# EasyEDA Pro project 基于LM2596的12V转53.3V.epro

# Schematic 基于LM2596的12V转53.3V copy
Board Name: 基于LM2596的12V转53.3V copy; Create Date: 2025-03-05; Page Name: Sheet_1 copy; Project Name: 基于LM2596的12V转53.3V copy_2025-03-05_14-51-58; Schematic Name: 基于LM2596的12V转53.3V copy; Update Date: 2025-03-08; Add into BOM: yes; Company: Your Company; Convert to PCB: yes; Date: 2021-05-23; Draw By: 衬衫的价格为九镑十五便士; REV: 1.0; Sheet: 1/1
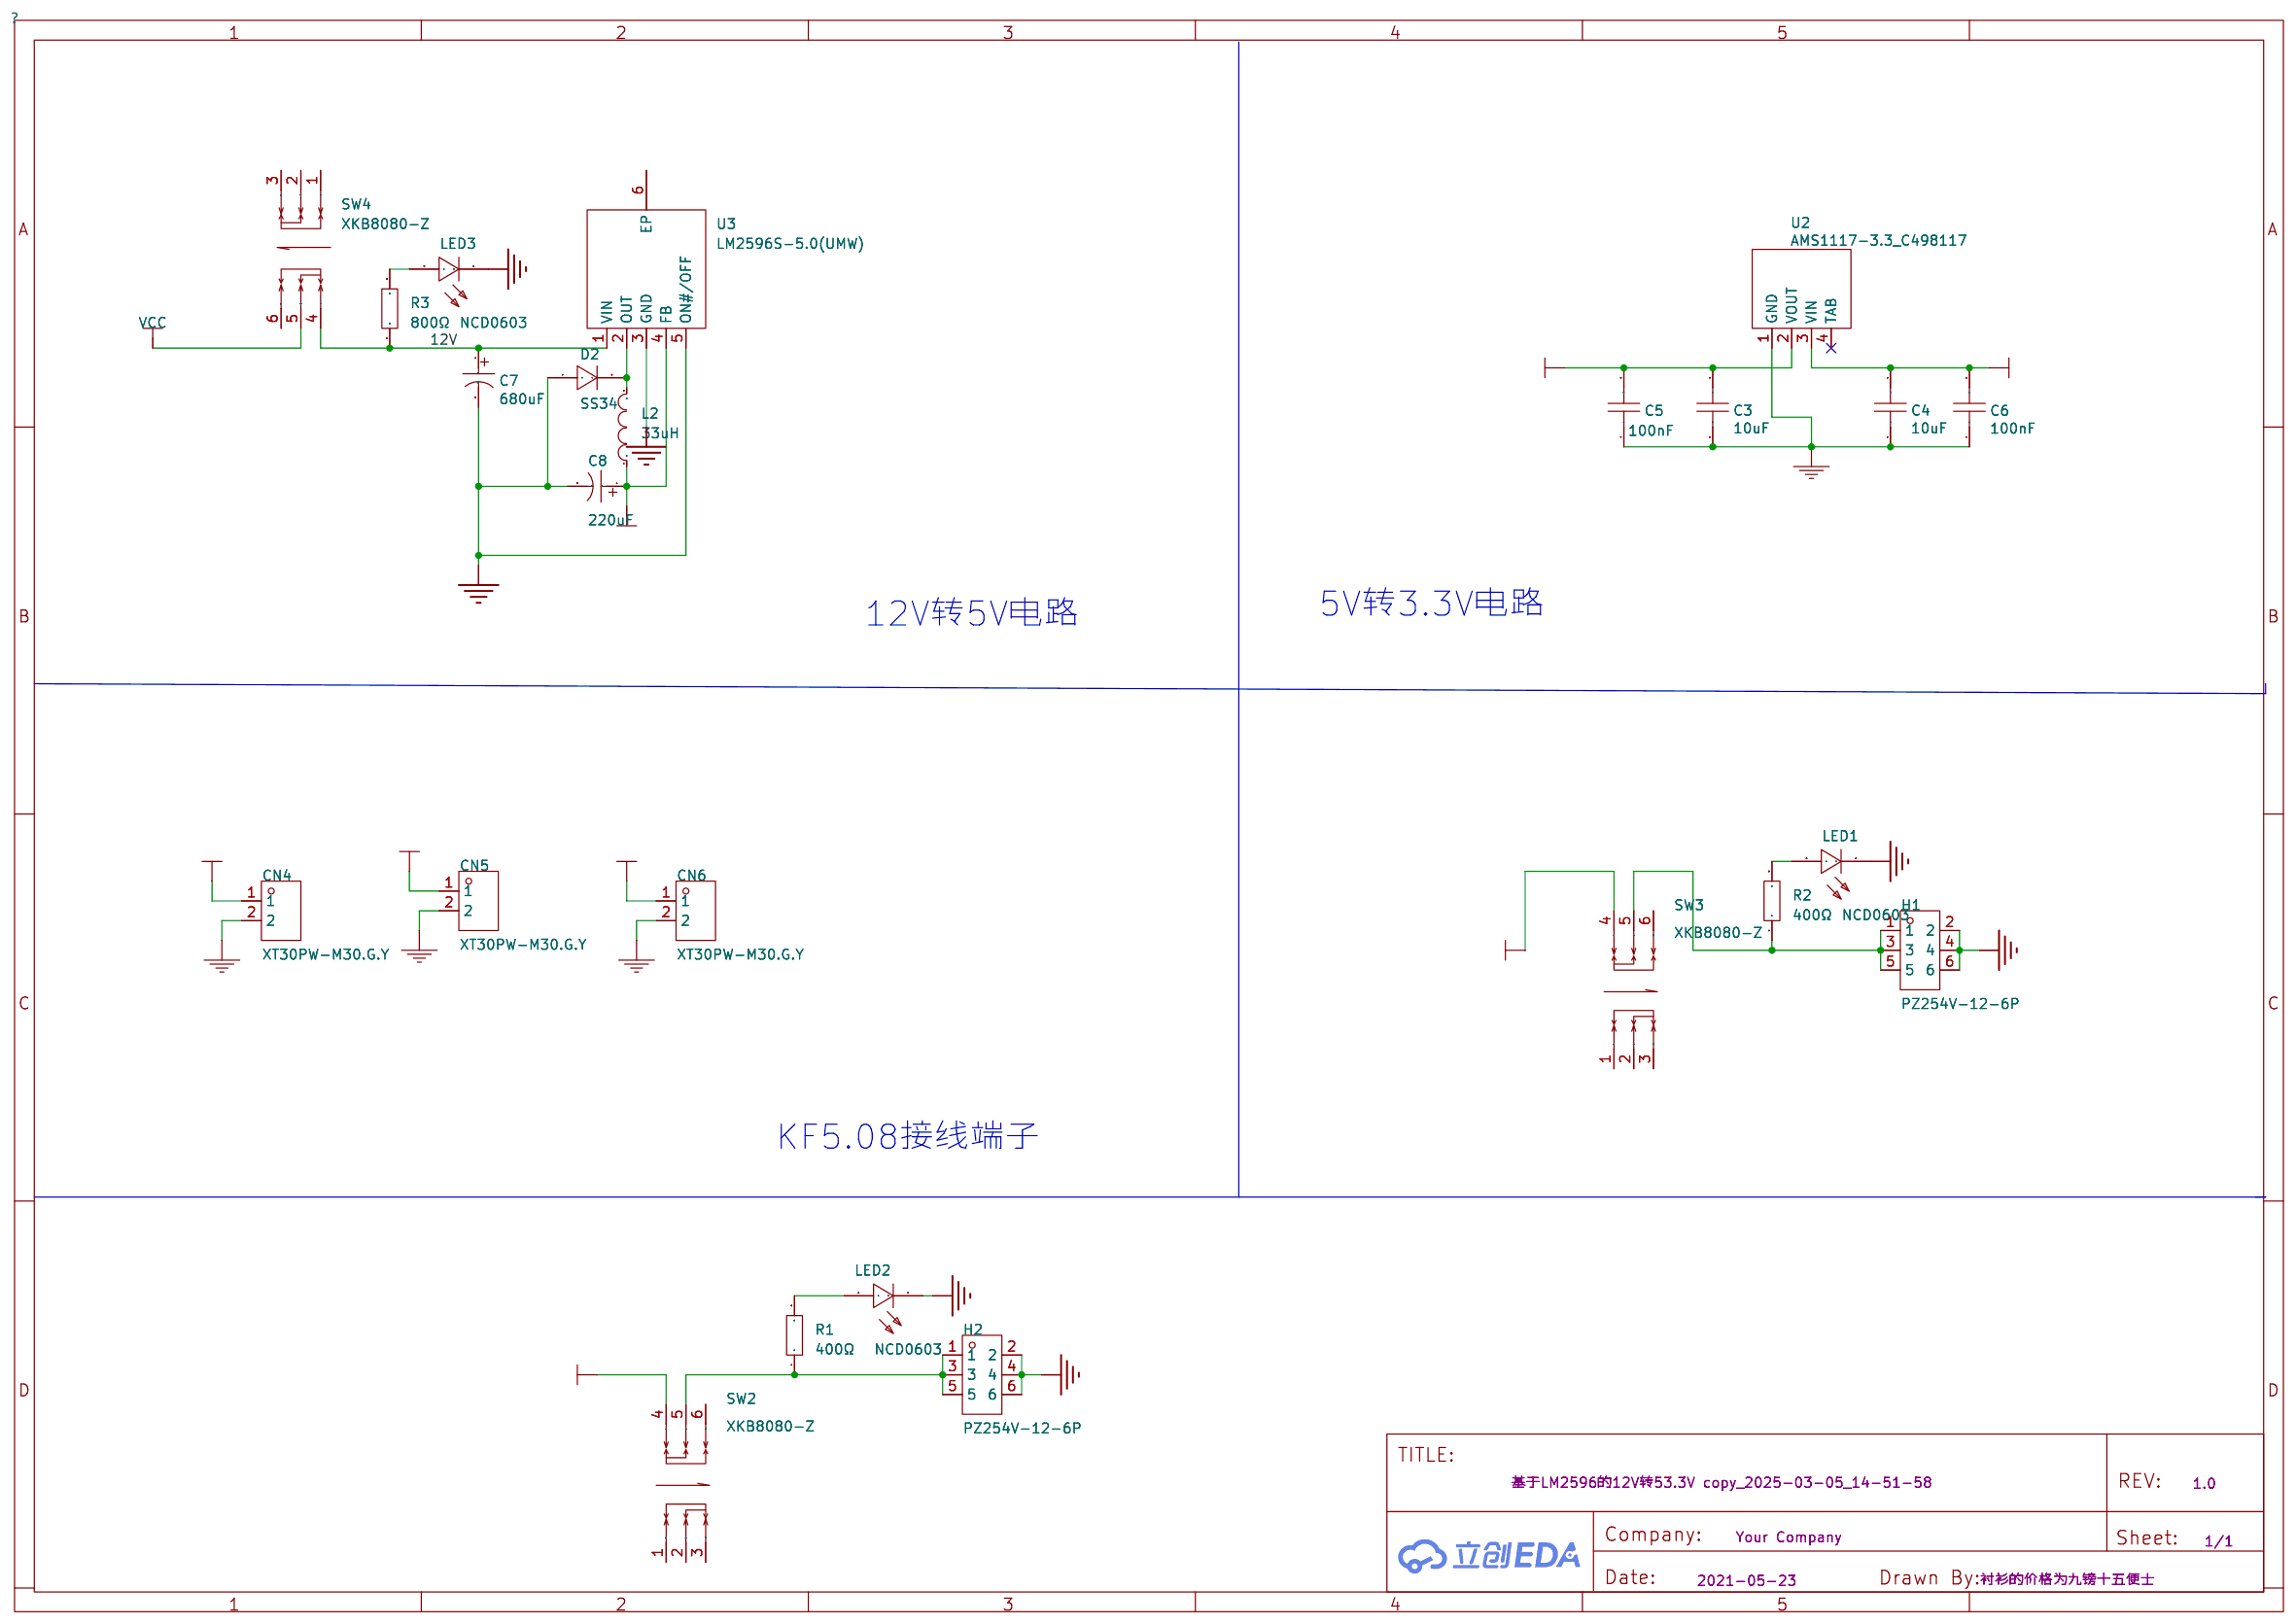
[diagram p0: schematic sheet]

## Parts
C3  10uF  [C0603]
C4  10uF  [C0603]
C5  100nF  [C0603]
C6  100nF  [C0603]
C7  680uF  [CAP-SMD_BD10.0-L10.3-W10.3-LS10.9-FD]
C8  220uF  [CAP-SMD_BD6.3-L6.6-W6.6-LS7.8-FD]
CN4  XT30PW-M30.G.Y  [CONN-TH_XT30PW-M]
CN5  XT30PW-M30.G.Y  [CONN-TH_XT30PW-M]
CN6  XT30PW-M30.G.Y  [CONN-TH_XT30PW-M]
D2  SS34  [SMC_L6.9-W5.9-LS7.9-RD]
H1  PZ254V-12-6P  [HDR-TH_6P-P2.54-V-M-R2-C3-S2.54]
H2  PZ254V-12-6P  [HDR-TH_6P-P2.54-V-M-R2-C3-S2.54]
L2  33uH  [IND-SMD_L7.0-W6.6_FXL0650]
LED1  NCD0603  [LED0603-RD_RED]
LED2  NCD0603  [LED0603-RD_RED]
LED3  NCD0603  [LED0603-RD_RED]
R1  400Ω  [R0603]
R2  400Ω  [R0603]
R3  800Ω  [R0603]
SW2  XKB8080-Z  [SW-TH_6P-L8.0-W8.0-P2.50]
SW3  XKB8080-Z  [SW-TH_6P-L8.0-W8.0-P2.50]
SW4  XKB8080-Z  [SW-TH_6P-L8.0-W8.0-P2.50]
U2  AMS1117-3.3_C498117  [PG-SOT223-4_L6.5-W3.5-P2.30-LS7.0-BR]
U3  LM2596S-5.0(UMW)  [TO-263-5_L10.2-W8.9-P1.70-BR]

## Library data of the parts
C3 C4 = GRT188R61E106ME13D: Supplier: LCSC; Supplier Part: C697423; Manufacturer: Murata Electronics; JLCPCB Part Class: Extended Part
C5 C6 = CT41-0603-2F4-50V-0.1uF-M(N): Supplier: LCSC; Supplier Part: C138344; Manufacturer: TORCH
C7 = GVM1V681M1010: 容值:680uF;精度:±20%;额定电压:35V;纹波电流:1.19A@120Hz;等效串联电阻:60mΩ@120Hz;; LCSC Part Name: 680uF ±20% 35V; Supplier Part: C2980172; Manufacturer: HONOR(荣誉); Supplier Footprint: SMD,D10xL10.5mm; JLCPCB Part Class: Extended Part; Datasheet: https://atta.szlcsc.com/upload/public/pdf/source/20220509/EB2A569F0F3393644DE07704993C28AA.pdf; Supplier: LCSC; Tolerance: ±20%; Rated Voltage: 35V; Ripple Current: 1.19A@120Hz; Equivalent Series Resistance(ESR): 60mΩ@120Hz; φD: 10mm; L: 10.2mm; Lifetime @ Temp: 5000hrs@105℃; Operating Temperature: -55℃~+105℃
C8 = GVT1E227M0608CNVC: 容值:220uF;精度:±20%;额定电压:25V;纹波电流:120mA@120Hz;; LCSC Part Name: 220uF ±20% 25V; Supplier Part: C2983317; Manufacturer: HRK(鸿瑞凯电子); Supplier Footprint: SMD,D6.3xL7.7mm; JLCPCB Part Class: Extended Part; Datasheet: https://atta.szlcsc.com/upload/public/pdf/source/20220321/A04A91A46495B899B204BF58325E1842.pdf; Supplier: LCSC; Tolerance: ±20%; Rated Voltage: 25V; Ripple Current: 120mA@120Hz; φD: 6.3mm; L: 8mm; Lifetime @ Temp: 2000hrs@105℃; Operating Temperature: -55℃~+105℃
CN4-CN6 = XT30PW-M30.G.Y: 类别:-;类型1:-;; LCSC Part Name: AMASS(艾迈斯)航模插头 卧式弯脚 XT30PW-M公头; Supplier Part: C431092; Manufacturer: AMASS(艾迈斯); JLCPCB Part Class: Extended Part; Datasheet: https://atta.szlcsc.com/upload/public/pdf/source/20220222/6A9F22F7850E25B33E1BE430ADF8560B.pdf; Supplier: LCSC; Type: 航模插头; RatedVoltage: DC 500V; InterfaceType: 公头; RatedCurrent: 15A; RecommendedWireGauge: 16/18/20AWG; contact resistance: 1.2mΩ; specifications: 2pin
D2 = SS34_C154551: 正向压降(Vf):500mV@3A;直流反向耐压(Vr):40V;整流电流:3A;; LCSC Part Name: 电压:40V 电流:3A; Supplier Part: C154551; Manufacturer: onsemi(安森美); Supplier Footprint: SMC(DO-214AB); JLCPCB Part Class: Extended Part; Datasheet: https://atta.szlcsc.com/upload/public/pdf/source/20230523/C977B907190B075B30FD168351032A84.pdf; Supplier: LCSC; Forward Voltage (Vf@If): 500mV@3A; Reverse Voltage (Vr): 40V; Rectified Current: 3A; Reverse Leakage Current (Ir): 500uA@40V
H1 H2 = PZ254V-12-6P: 插针结构:2x3P;间距:2.54mm;行距:2.54mm;圆针/方针:方针;安装类型:直插;排数:双排;总PIN位数:6P;额定电流:-;额定电压:-;配合针长度:6mm;塑高:2.5mm;端接针长度:3mm;触头材质:黄铜;触头镀层:-;工作温度范围:-40℃~+105℃;颜色:黑色;; LCSC Part Name: 间距:2.54mm 2x3P 直插 方针; Supplier Part: C492420; Manufacturer: XFCN(兴飞); Supplier Footprint: 插件,P=2.54mm; JLCPCB Part Class: 扩展库; Datasheet: https://atta.szlcsc.com/upload/public/pdf/source/20200309/C492420_BAECB307B001054C09D200388220EAE6.pdf; Supplier: LCSC; Pin Structure: 2x3P; Pitch: 2.54mm; Row Spacing: 2.54mm; Circluar Pins/Square Pins: 方针; Mounting Type: 直插; Number of Rows: 双排; Number of Pins: 6P; Length of Mating Pin: 6mm; Insulation Height: 2.5mm; Length of End Connection Pin: 3mm; Contact Material: 黄铜; Operating Temperature Range: -40℃~+105℃; Color: 黑色
L2 = FXL0650-330-M: 电感值:33uH;精度:±20%;额定电流:2.3A;饱和电流(Isat):3A;类型:一体成型电感;; LCSC Part Name: 33uH ±20% 3A; Supplier Part: C475526; Manufacturer: cjiang(长江微电); Supplier Footprint: SMD,6.6x7mm; JLCPCB Part Class: Extended Part; Datasheet: https://atta.szlcsc.com/upload/public/pdf/source/20240426/3189EA8206330E2108542F9E34E540E7.pdf; Supplier: LCSC; Tolerance: ±20%; Rated Current: 2.3A; Saturation Current (Isat): 3A; DC Resistance (DCR): 190mΩ; Type: 一体成型电感
LED1-LED3 = NCD0603R1_C84263: 灯头类型:-;发光颜色:红色;正向电压(VF):1.6V~2.6V;功率:65mW;正向电流:20mA;主波长:615nm~630nm;二极管配置:独立二极管;透镜颜色:无色透明透镜;色温:-;发光强度:80mcd~220mcd;发光角度:130°;载带方式:-;工作温度:-30℃~+85℃;; LCSC Part Name: NCD0603R1; Supplier Part: C84263; Manufacturer: 国星光电; Supplier Footprint: 0603; JLCPCB Part Class: 扩展库; Datasheet: https://atta.szlcsc.com/upload/public/pdf/source/20200820/C84263_DABC6A75E58F576973B407FDBA283D60.pdf; Supplier: LCSC; Emitted Color: 红色; Forward Voltage (VF): 1.6V~2.6V; Power Dissipation: 65mW; Forward Current: 20mA; Dominant Wavelength: 615nm~630nm; Diode Configuration: 独立二极管; Lens Color: 无色透明透镜; Luminous Intensity: 80mcd~220mcd; Viewing Angle: 130°; Operating Temperature: -30℃~+85℃
R1-R3 = Res_0603: Supplier Footprint: 0603
SW2-SW4 = XKB8080-Z: 自锁/无锁:自锁;安装方式:直插;触点电流:100mA;额定电压 (AC):250V;额定电压 (DC):30V;带灯:不带;作用力:160gf;机械寿命:10万次;; LCSC Part Name: 8*8 蓝白黑 自锁开关; Supplier Part: C318860; Manufacturer: XKB Connectivity(中国星坤); Supplier Footprint: 插件; JLCPCB Part Class: 扩展库; Datasheet: https://atta.szlcsc.com/upload/public/pdf/source/20200227/C318861_0CCDF4510CAD1098054D1FAD25282ED5.pdf; Supplier: LCSC; Self Lock / No Lock: 自锁; Actuator Style: 矩形按钮; Mounting Style: 直插; Contact Current: 100mA; Voltage Rating (AC): 250V; Voltage Rating (DC): 30V; Insulation Resistance: 100MΩ; Actuator/Cap Color: 蓝色; With Lamp: 不带; Pin Style: PC引脚; Operating Force: 160gf; Operating Temperature: -15℃~+55℃; Mechanical Life: 10万次
U2 = AMS1117-3.3: Supplier: LCSC; Supplier Part: C498117; Manufacturer: HGC(Huaguan Semicon); JLCPCB Part Class: Extended Part
U3 = LM2596S-5.0(UMW): 功能类型:降压型;输出类型:固定;工作电压:7V~40V;输出电压:5V;输出电流:3A;; LCSC Part Name: 3A降压稳压器; Supplier Part: C347421; Manufacturer: UMW(友台半导体); Supplier Footprint: TO-263-5; JLCPCB Part Class: Extended Part; Datasheet: https://atta.szlcsc.com/upload/public/pdf/source/20241113/7515F50B4FEE0270D4DE7078364C87FA.pdf; Supplier: LCSC; Function: 降压型; Output Type: 固定; Input Voltage: 7V~40V; Output Voltage: 5V; Output Current: 3A; Switching Frequency: 150kHz; Operating Temperature: -40℃~+125℃@(TA); Synchronous Rectification: 否; Number of Outputs: 1; Topology: 降压式; Quiescent Current (Iq): 80uA; Switch tube (built-in/external): 内置

## Nets
3.3V: C3.1 C5.2 SW2.4 U2.2(VOUT)
5V: C4.1 C6.2 C8.1 L2.1 SW3.4 U2.3(VIN) U3.4(FB)
12V: C7.1 CN5.1 CN6.1 R3.1 SW4.4 U3.1(VIN)
GND: C3.2 C4.2 C5.1 C6.1 C7.2 C8.2 CN4.2 CN5.2 CN6.2 D2.1(A) H1.2 H1.4 H1.6 H2.2 H2.4 H2.6 LED1.1(K) LED2.1(K) LED3.1(K) U2.1(GND) U3.3(GND) U3.5(ON#/OFF)
VCC: CN4.1 SW4.5
$1N1457: D2.2(K) L2.2 U3.2(OUT)
$1N4140: LED1.2(A) R2.2
$1N4171: LED2.2(A) R1.2
$1N4370: LED3.2(A) R3.2
Net-(H1-1): H1.1 H1.3 H1.5 R2.1 SW3.5
Net-(H2-1): H2.1 H2.3 H2.5 R1.1 SW2.5

Not connected (* = marked no-connect by the designer): SW2 1 2 3 6; SW3 1 2 3 6; SW4 1 2 3 6; U2 4(TAB)*; U3 6(EP)

## Notes on the sheet
- 12V转5V电路
- 5V转3.3V电路
- KF5.08接线端子

# Schematic 基于LM2596的12V转53.3V copy copy
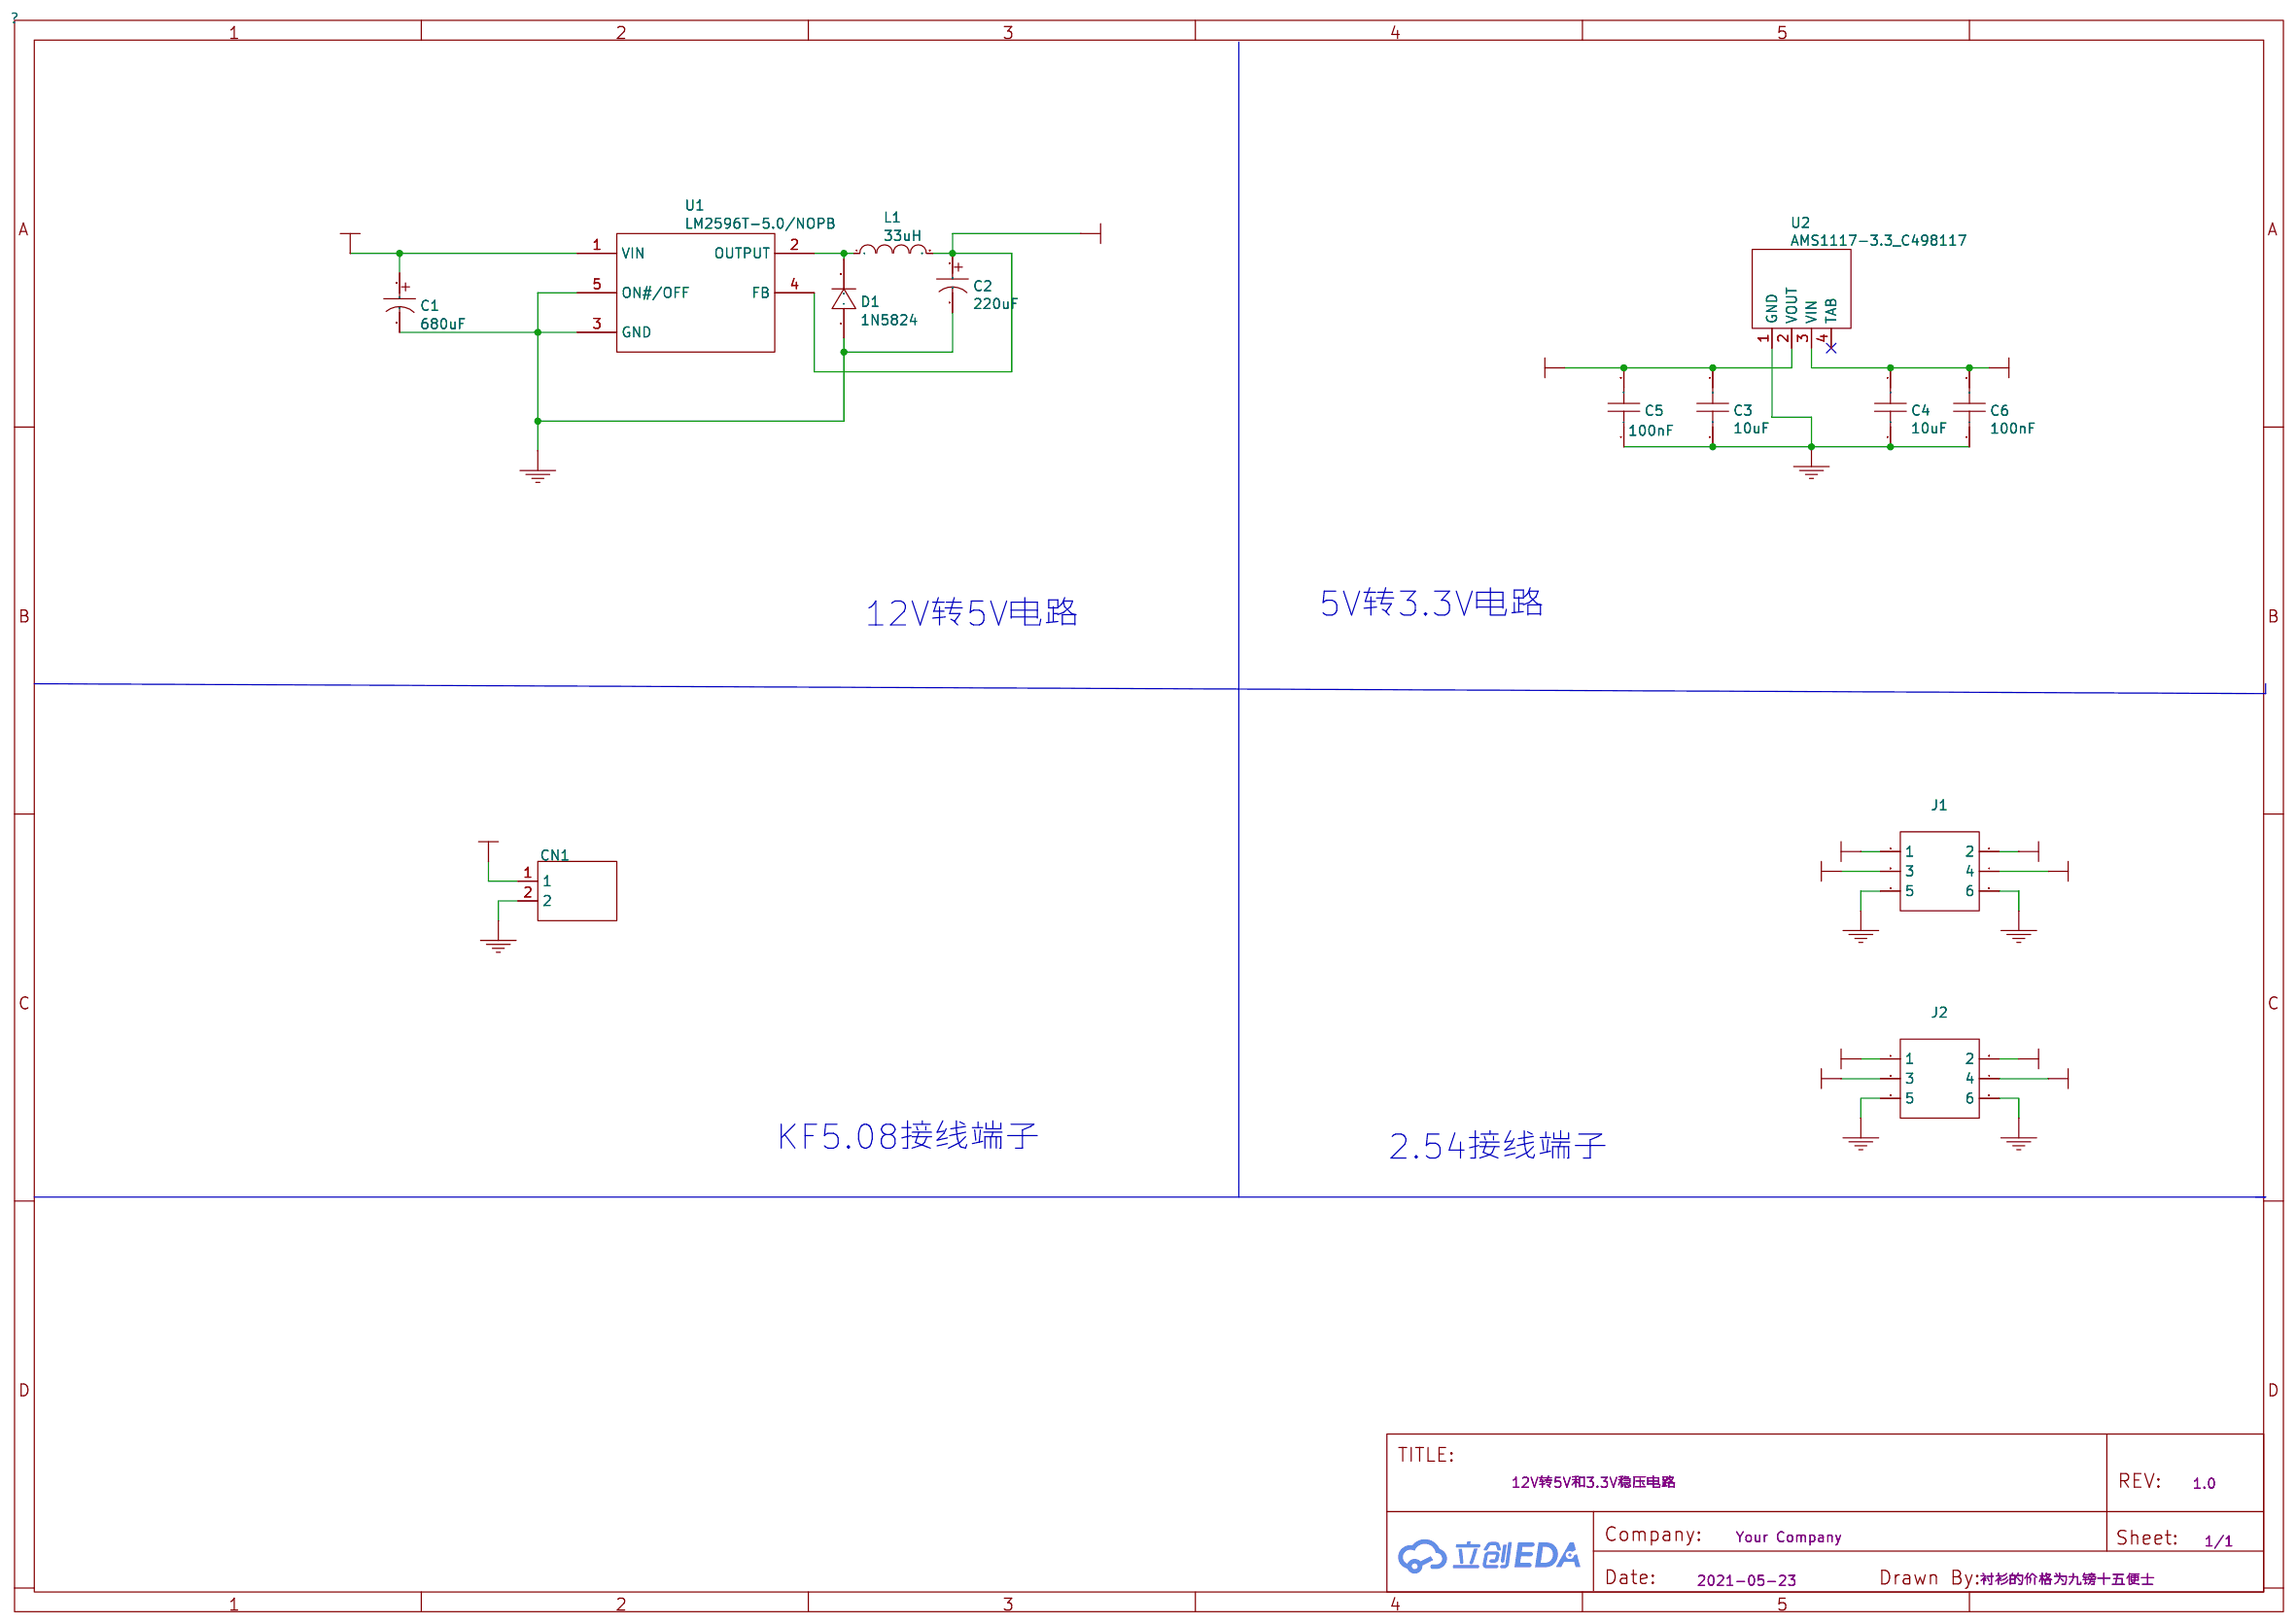
[diagram p1: schematic sheet]

## Parts
C1  680uF  [CAP-TH_BD12.5-P5.00-D1.2-FD]
C2  220uF  [CAP-TH_BD8.0-P3.50-D1.0-FD]
C3  10uF  [C0603]
C4  10uF  [C0603]
C5  100nF  [C0603]
C6  100nF  [C0603]
CN1  WJ127-5.0-2P_C187897  [CONN-TH_2P-P5.00_WJ127-5.0-2P]
D1  1N5824  [IN5824]
J1  Header-Male-2.54_2x3  [HDR-TH_6P-P2.54-V-R2-C3-S2.54]
J2  Header-Male-2.54_2x3  [HDR-TH_6P-P2.54-V-R2-C3-S2.54]
L1  33uH  [IND-SMD_L6.0-W6.0]
U1  LM2596T-5.0/NOPB  [TO-220-5_L10.5-W15.5-P1.70-TL]
U2  AMS1117-3.3_C498117  [PG-SOT223-4_L6.5-W3.5-P2.30-LS7.0-BR]

## Library data of the parts
C1 = 680UF/50V Black high frequency: Supplier: LCSC; Manufacturer: ValuePro; Supplier Part: C26225
C2 = 220uF 25V 8*12: Supplier: LCSC; Manufacturer: ValuePro; Supplier Part: C43837
C3 C4 = GRT188R61E106ME13D: Supplier: LCSC; Supplier Part: C697423; Manufacturer: Murata Electronics; JLCPCB Part Class: Extended Part
C5 C6 = CT41-0603-2F4-50V-0.1uF-M(N): Supplier: LCSC; Supplier Part: C138344; Manufacturer: TORCH
CN1 = WJ127-5.0-2P: Supplier: LCSC; Supplier Part: C187897; Manufacturer: Ningbo Kangnex Elec
D1 = 1N5824
J1 J2 = Header-Male-2.54_2x3: Supplier: LCSC; Manufacturer: BOOMELE; Supplier Part: C65114; JLCPCB Part Class: Extended Part
L1 = CKCS6045-33uH/M: Supplier: LCSC; Supplier Part: C354635; Manufacturer: CENKER; JLCPCB Part Class: Extended Part
U1 = LM2596T-5.0/NOPB: Supplier: LCSC; Manufacturer: TI; Supplier Part: C9714; JLCPCB Part Class: Extended Part
U2 = AMS1117-3.3: Supplier: LCSC; Supplier Part: C498117; Manufacturer: HGC(Huaguan Semicon); JLCPCB Part Class: Extended Part

## Nets
3.3V: C3.1 C5.2 J1.3 J1.4 J2.3 J2.4 U2.2(VOUT)
5V: C2.1 C4.1 C6.2 J1.1 J1.2 J2.1 J2.2 L1.2 U1.4(FB) U2.3(VIN)
12V: C1.1 CN1.1 U1.1(VIN)
GND: C1.2 C2.2 C3.2 C4.2 C5.1 C6.1 CN1.2 D1.1(A) J1.5 J1.6 J2.5 J2.6 U1.3(GND) U1.5(ON#/OFF) U2.1(GND)
U1_2: D1.2(K) L1.1 U1.2(OUTPUT)

Not connected (* = marked no-connect by the designer): U2 4(TAB)*

## Notes on the sheet
- 12V转5V电路
- 5V转3.3V电路
- KF5.08接线端子
- 2.54接线端子

# Schematic 基于LM2596的12V转53.3V copy_1
Board Name: V1.1; Create Date: 2025-03-16; Page Name: Sheet_1 copy; Project Name: 基于LM2596的12V转53.3V copy_2025-03-05_14-51-58; Schematic Name: 基于LM2596的12V转53.3V copy_1; Update Date: 2025-03-16; Add into BOM: yes; Company: Your Company; Convert to PCB: yes; Date: 2021-05-23; Draw By: 衬衫的价格为九镑十五便士; REV: 1.0; Sheet: 1/1
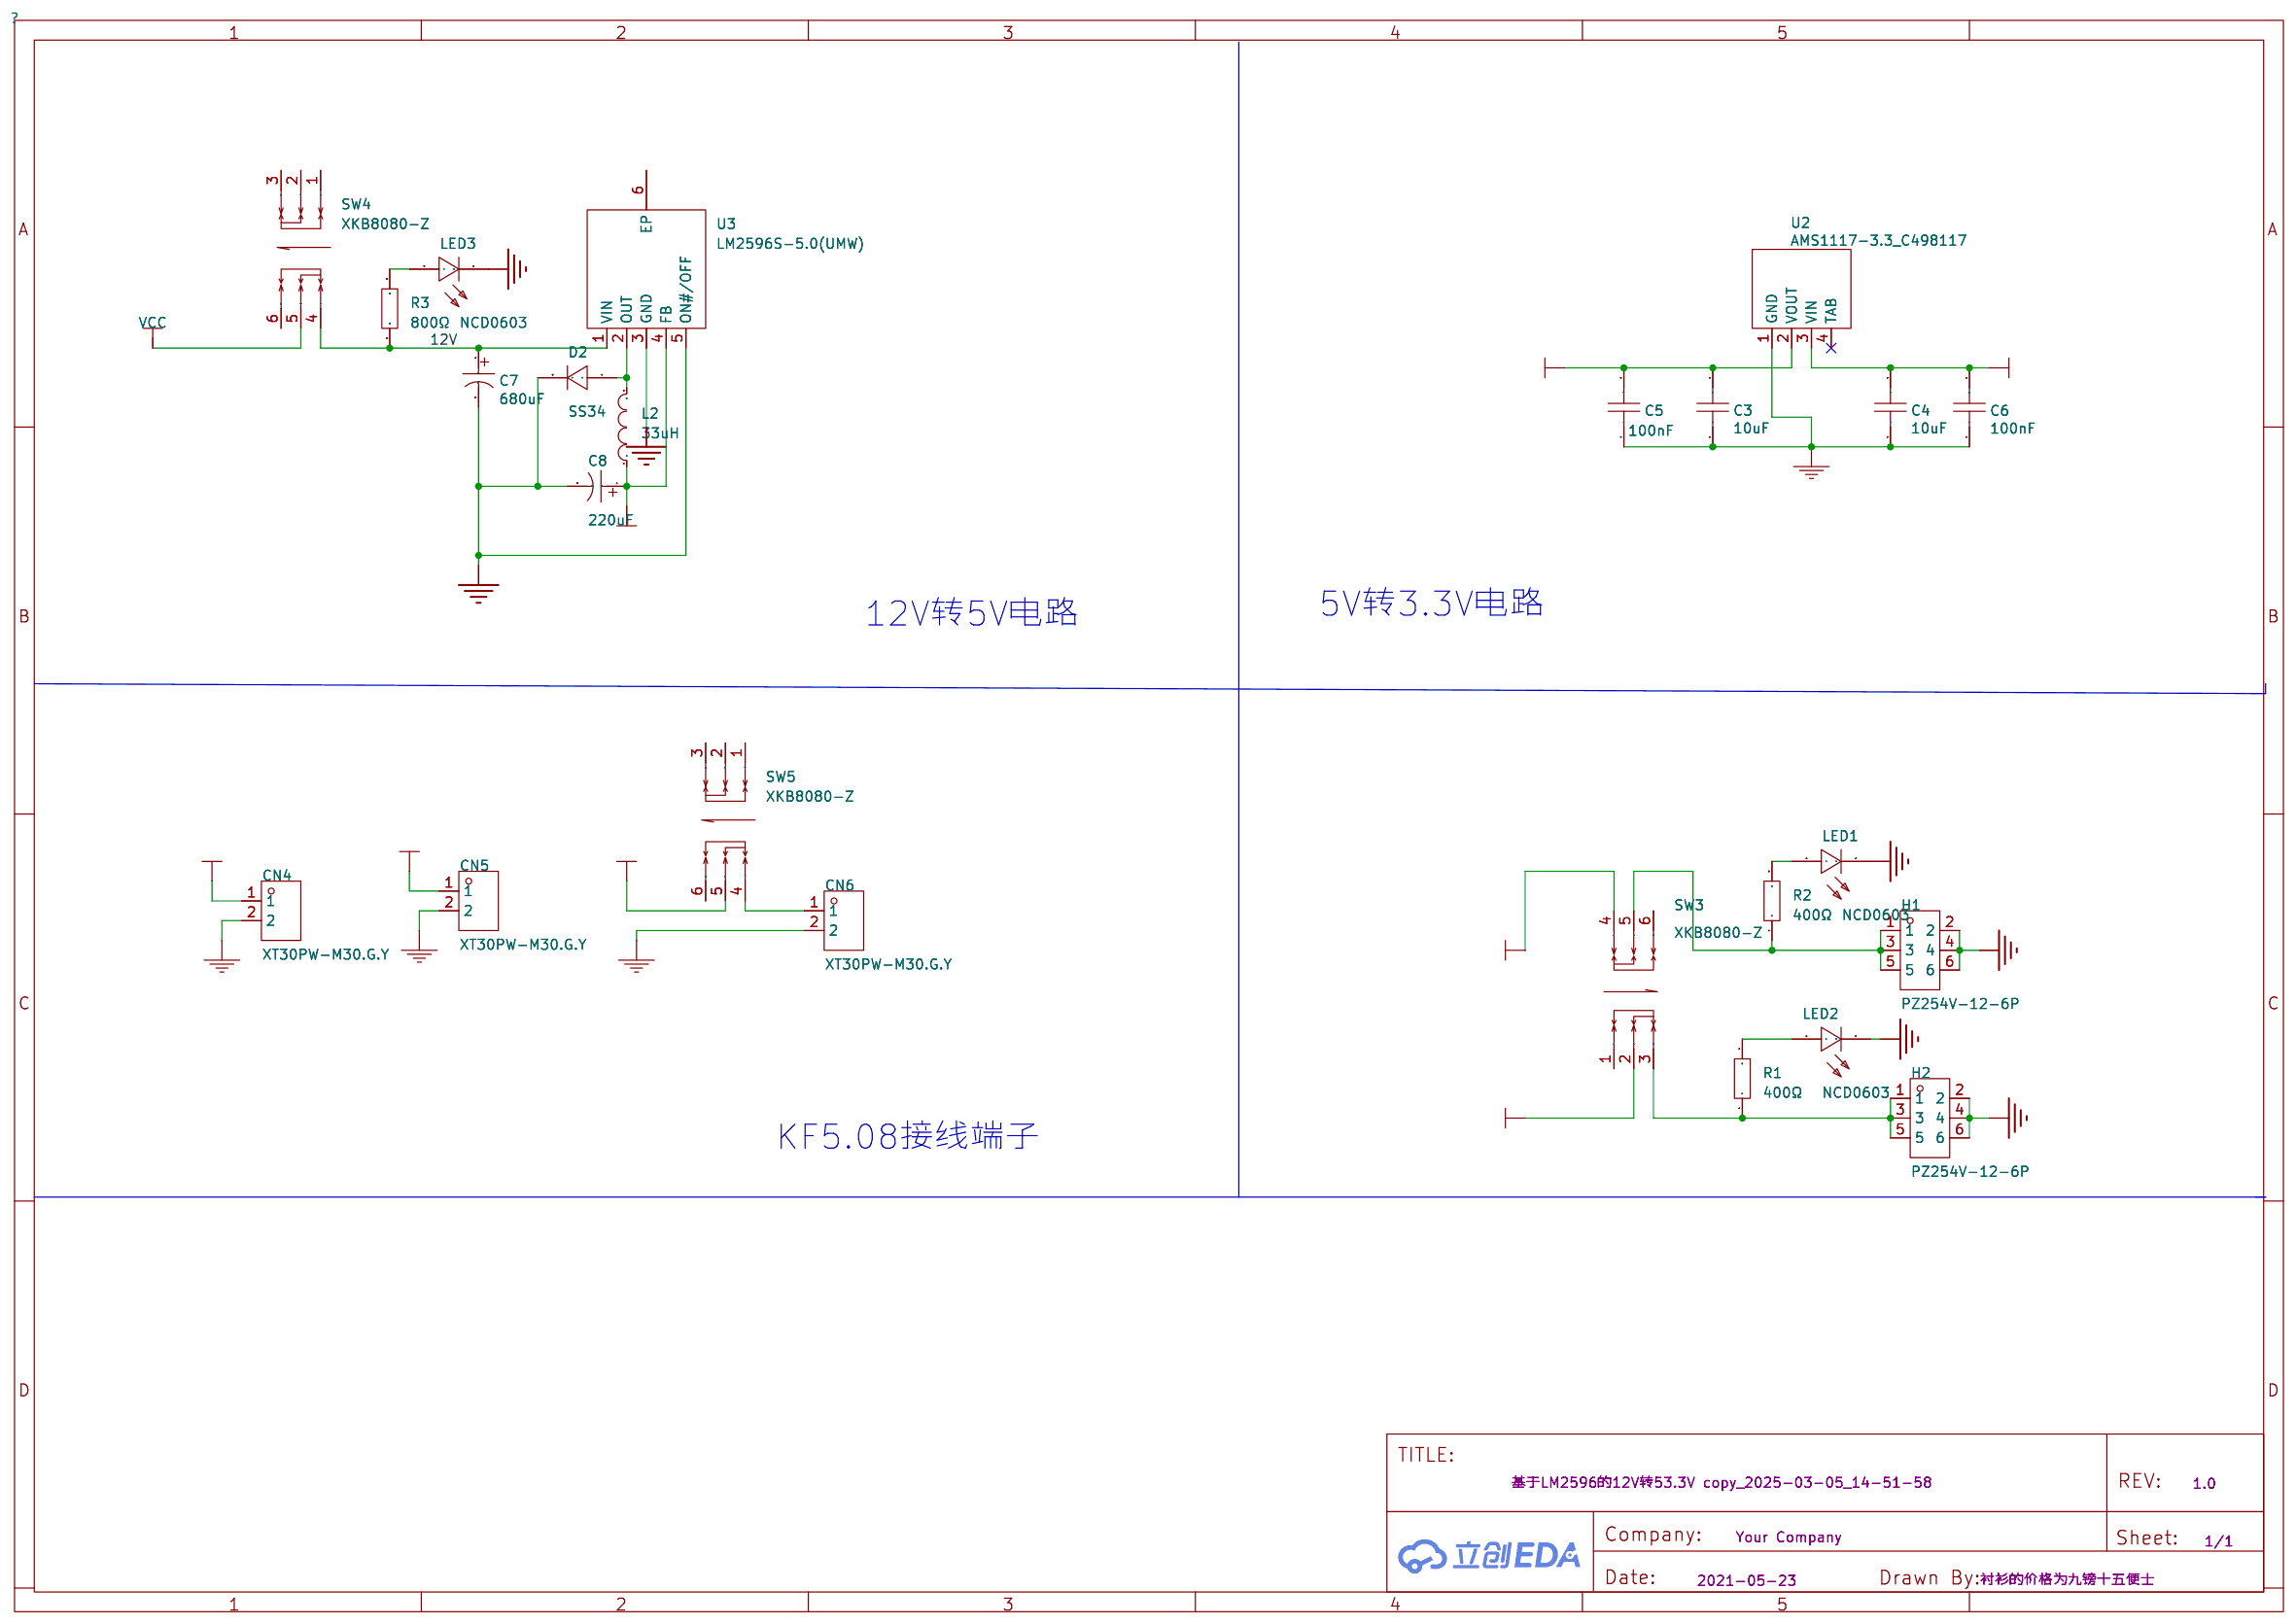
[diagram p2: schematic sheet]

## Parts
C3  10uF  [C0603]
C4  10uF  [C0603]
C5  100nF  [C0603]
C6  100nF  [C0603]
C7  680uF  [CAP-SMD_BD10.0-L10.3-W10.3-LS10.9-FD]
C8  220uF  [CAP-SMD_BD6.3-L6.6-W6.6-LS7.8-FD]
CN4  XT30PW-M30.G.Y  [CONN-TH_XT30PW-M]
CN5  XT30PW-M30.G.Y  [CONN-TH_XT30PW-M]
CN6  XT30PW-M30.G.Y  [CONN-TH_XT30PW-M]
D2  SS34  [SMC_L6.9-W5.9-LS7.9-RD]
H1  PZ254V-12-6P  [HDR-TH_6P-P2.54-V-M-R2-C3-S2.54]
H2  PZ254V-12-6P  [HDR-TH_6P-P2.54-V-M-R2-C3-S2.54]
L2  33uH  [IND-SMD_L7.0-W6.6_FXL0650]
LED1  NCD0603  [LED0603-RD_RED]
LED2  NCD0603  [LED0603-RD_RED]
LED3  NCD0603  [LED0603-RD_RED]
R1  400Ω  [R0603]
R2  400Ω  [R0603]
R3  800Ω  [R0603]
SW3  XKB8080-Z  [SW-TH_6P-L8.0-W8.0-P2.50]
SW4  XKB8080-Z  [SW-TH_6P-L8.0-W8.0-P2.50]
SW5  XKB8080-Z  [SW-TH_6P-L8.0-W8.0-P2.50]
U2  AMS1117-3.3_C498117  [PG-SOT223-4_L6.5-W3.5-P2.30-LS7.0-BR]
U3  LM2596S-5.0(UMW)  [TO-263-5_L10.2-W8.9-P1.70-BR]

## Library data of the parts
C3 C4 = GRT188R61E106ME13D: Supplier: LCSC; Supplier Part: C697423; Manufacturer: Murata Electronics; JLCPCB Part Class: Extended Part
C5 C6 = CT41-0603-2F4-50V-0.1uF-M(N): Supplier: LCSC; Supplier Part: C138344; Manufacturer: TORCH
C7 = GVM1V681M1010: 容值:680uF;精度:±20%;额定电压:35V;纹波电流:1.19A@120Hz;等效串联电阻:60mΩ@120Hz;; LCSC Part Name: 680uF ±20% 35V; Supplier Part: C2980172; Manufacturer: HONOR(荣誉); Supplier Footprint: SMD,D10xL10.5mm; JLCPCB Part Class: Extended Part; Datasheet: https://atta.szlcsc.com/upload/public/pdf/source/20220509/EB2A569F0F3393644DE07704993C28AA.pdf; Supplier: LCSC; Tolerance: ±20%; Rated Voltage: 35V; Ripple Current: 1.19A@120Hz; Equivalent Series Resistance(ESR): 60mΩ@120Hz; φD: 10mm; L: 10.2mm; Lifetime @ Temp: 5000hrs@105℃; Operating Temperature: -55℃~+105℃
C8 = GVT1E227M0608CNVC: 容值:220uF;精度:±20%;额定电压:25V;纹波电流:120mA@120Hz;; LCSC Part Name: 220uF ±20% 25V; Supplier Part: C2983317; Manufacturer: HRK(鸿瑞凯电子); Supplier Footprint: SMD,D6.3xL7.7mm; JLCPCB Part Class: Extended Part; Datasheet: https://atta.szlcsc.com/upload/public/pdf/source/20220321/A04A91A46495B899B204BF58325E1842.pdf; Supplier: LCSC; Tolerance: ±20%; Rated Voltage: 25V; Ripple Current: 120mA@120Hz; φD: 6.3mm; L: 8mm; Lifetime @ Temp: 2000hrs@105℃; Operating Temperature: -55℃~+105℃
CN4-CN6 = XT30PW-M30.G.Y: 类别:-;类型1:-;; LCSC Part Name: AMASS(艾迈斯)航模插头 卧式弯脚 XT30PW-M公头; Supplier Part: C431092; Manufacturer: AMASS(艾迈斯); JLCPCB Part Class: Extended Part; Datasheet: https://atta.szlcsc.com/upload/public/pdf/source/20220222/6A9F22F7850E25B33E1BE430ADF8560B.pdf; Supplier: LCSC; Type: 航模插头; RatedVoltage: DC 500V; InterfaceType: 公头; RatedCurrent: 15A; RecommendedWireGauge: 16/18/20AWG; contact resistance: 1.2mΩ; specifications: 2pin
D2 = SS34_C154551: 正向压降(Vf):500mV@3A;直流反向耐压(Vr):40V;整流电流:3A;; LCSC Part Name: 电压:40V 电流:3A; Supplier Part: C154551; Manufacturer: onsemi(安森美); Supplier Footprint: SMC(DO-214AB); JLCPCB Part Class: Extended Part; Datasheet: https://atta.szlcsc.com/upload/public/pdf/source/20230523/C977B907190B075B30FD168351032A84.pdf; Supplier: LCSC; Forward Voltage (Vf@If): 500mV@3A; Reverse Voltage (Vr): 40V; Rectified Current: 3A; Reverse Leakage Current (Ir): 500uA@40V
H1 H2 = PZ254V-12-6P: 插针结构:2x3P;间距:2.54mm;行距:2.54mm;圆针/方针:方针;安装类型:直插;排数:双排;总PIN位数:6P;额定电流:-;额定电压:-;配合针长度:6mm;塑高:2.5mm;端接针长度:3mm;触头材质:黄铜;触头镀层:-;工作温度范围:-40℃~+105℃;颜色:黑色;; LCSC Part Name: 间距:2.54mm 2x3P 直插 方针; Supplier Part: C492420; Manufacturer: XFCN(兴飞); Supplier Footprint: 插件,P=2.54mm; JLCPCB Part Class: 扩展库; Datasheet: https://atta.szlcsc.com/upload/public/pdf/source/20200309/C492420_BAECB307B001054C09D200388220EAE6.pdf; Supplier: LCSC; Pin Structure: 2x3P; Pitch: 2.54mm; Row Spacing: 2.54mm; Circluar Pins/Square Pins: 方针; Mounting Type: 直插; Number of Rows: 双排; Number of Pins: 6P; Length of Mating Pin: 6mm; Insulation Height: 2.5mm; Length of End Connection Pin: 3mm; Contact Material: 黄铜; Operating Temperature Range: -40℃~+105℃; Color: 黑色
L2 = FXL0650-330-M: 电感值:33uH;精度:±20%;额定电流:2.3A;饱和电流(Isat):3A;类型:一体成型电感;; LCSC Part Name: 33uH ±20% 3A; Supplier Part: C475526; Manufacturer: cjiang(长江微电); Supplier Footprint: SMD,6.6x7mm; JLCPCB Part Class: Extended Part; Datasheet: https://atta.szlcsc.com/upload/public/pdf/source/20240426/3189EA8206330E2108542F9E34E540E7.pdf; Supplier: LCSC; Tolerance: ±20%; Rated Current: 2.3A; Saturation Current (Isat): 3A; DC Resistance (DCR): 190mΩ; Type: 一体成型电感
LED1-LED3 = NCD0603R1_C84263: 灯头类型:-;发光颜色:红色;正向电压(VF):1.6V~2.6V;功率:65mW;正向电流:20mA;主波长:615nm~630nm;二极管配置:独立二极管;透镜颜色:无色透明透镜;色温:-;发光强度:80mcd~220mcd;发光角度:130°;载带方式:-;工作温度:-30℃~+85℃;; LCSC Part Name: NCD0603R1; Supplier Part: C84263; Manufacturer: 国星光电; Supplier Footprint: 0603; JLCPCB Part Class: 扩展库; Datasheet: https://atta.szlcsc.com/upload/public/pdf/source/20200820/C84263_DABC6A75E58F576973B407FDBA283D60.pdf; Supplier: LCSC; Emitted Color: 红色; Forward Voltage (VF): 1.6V~2.6V; Power Dissipation: 65mW; Forward Current: 20mA; Dominant Wavelength: 615nm~630nm; Diode Configuration: 独立二极管; Lens Color: 无色透明透镜; Luminous Intensity: 80mcd~220mcd; Viewing Angle: 130°; Operating Temperature: -30℃~+85℃
R1-R3 = Res_0603: Supplier Footprint: 0603
SW3-SW5 = XKB8080-Z: 自锁/无锁:自锁;安装方式:直插;触点电流:100mA;额定电压 (AC):250V;额定电压 (DC):30V;带灯:不带;作用力:160gf;机械寿命:10万次;; LCSC Part Name: 8*8 蓝白黑 自锁开关; Supplier Part: C318860; Manufacturer: XKB Connectivity(中国星坤); Supplier Footprint: 插件; JLCPCB Part Class: 扩展库; Datasheet: https://atta.szlcsc.com/upload/public/pdf/source/20200227/C318861_0CCDF4510CAD1098054D1FAD25282ED5.pdf; Supplier: LCSC; Self Lock / No Lock: 自锁; Actuator Style: 矩形按钮; Mounting Style: 直插; Contact Current: 100mA; Voltage Rating (AC): 250V; Voltage Rating (DC): 30V; Insulation Resistance: 100MΩ; Actuator/Cap Color: 蓝色; With Lamp: 不带; Pin Style: PC引脚; Operating Force: 160gf; Operating Temperature: -15℃~+55℃; Mechanical Life: 10万次
U2 = AMS1117-3.3: Supplier: LCSC; Supplier Part: C498117; Manufacturer: HGC(Huaguan Semicon); JLCPCB Part Class: Extended Part
U3 = LM2596S-5.0(UMW): 功能类型:降压型;输出类型:固定;工作电压:7V~40V;输出电压:5V;输出电流:3A;; LCSC Part Name: 3A降压稳压器; Supplier Part: C347421; Manufacturer: UMW(友台半导体); Supplier Footprint: TO-263-5; JLCPCB Part Class: Extended Part; Datasheet: https://atta.szlcsc.com/upload/public/pdf/source/20241113/7515F50B4FEE0270D4DE7078364C87FA.pdf; Supplier: LCSC; Function: 降压型; Output Type: 固定; Input Voltage: 7V~40V; Output Voltage: 5V; Output Current: 3A; Switching Frequency: 150kHz; Operating Temperature: -40℃~+125℃@(TA); Synchronous Rectification: 否; Number of Outputs: 1; Topology: 降压式; Quiescent Current (Iq): 80uA; Switch tube (built-in/external): 内置

## Nets
3.3V: C3.1 C5.2 SW3.2 U2.2(VOUT)
5V: C4.1 C6.2 C8.1 L2.1 SW3.4 U2.3(VIN) U3.4(FB)
12V: C7.1 CN5.1 R3.1 SW4.4 SW5.5 U3.1(VIN)
GND: C3.2 C4.2 C5.1 C6.1 C7.2 C8.2 CN4.2 CN5.2 CN6.2 D2.2(K) H1.2 H1.4 H1.6 H2.2 H2.4 H2.6 LED1.1(K) LED2.1(K) LED3.1(K) U2.1(GND) U3.3(GND) U3.5(ON#/OFF)
VCC: CN4.1 SW4.5
$1N1457: D2.1(A) L2.2 U3.2(OUT)
$1N2113: H1.1 H1.3 H1.5 R2.1 SW3.5
$1N2166: H2.1 H2.3 H2.5 R1.1 SW3.3
$1N4140: LED1.2(A) R2.2
$1N4171: LED2.2(A) R1.2
$1N4370: LED3.2(A) R3.2
$1N6771: CN6.1 SW5.4

Not connected (* = marked no-connect by the designer): SW3 1 6; SW4 1 2 3 6; SW5 1 2 3 6; U2 4(TAB)*; U3 6(EP)

## Notes on the sheet
- 12V转5V电路
- 5V转3.3V电路
- KF5.08接线端子

# Board PCB_12V转5v验证电路 copy
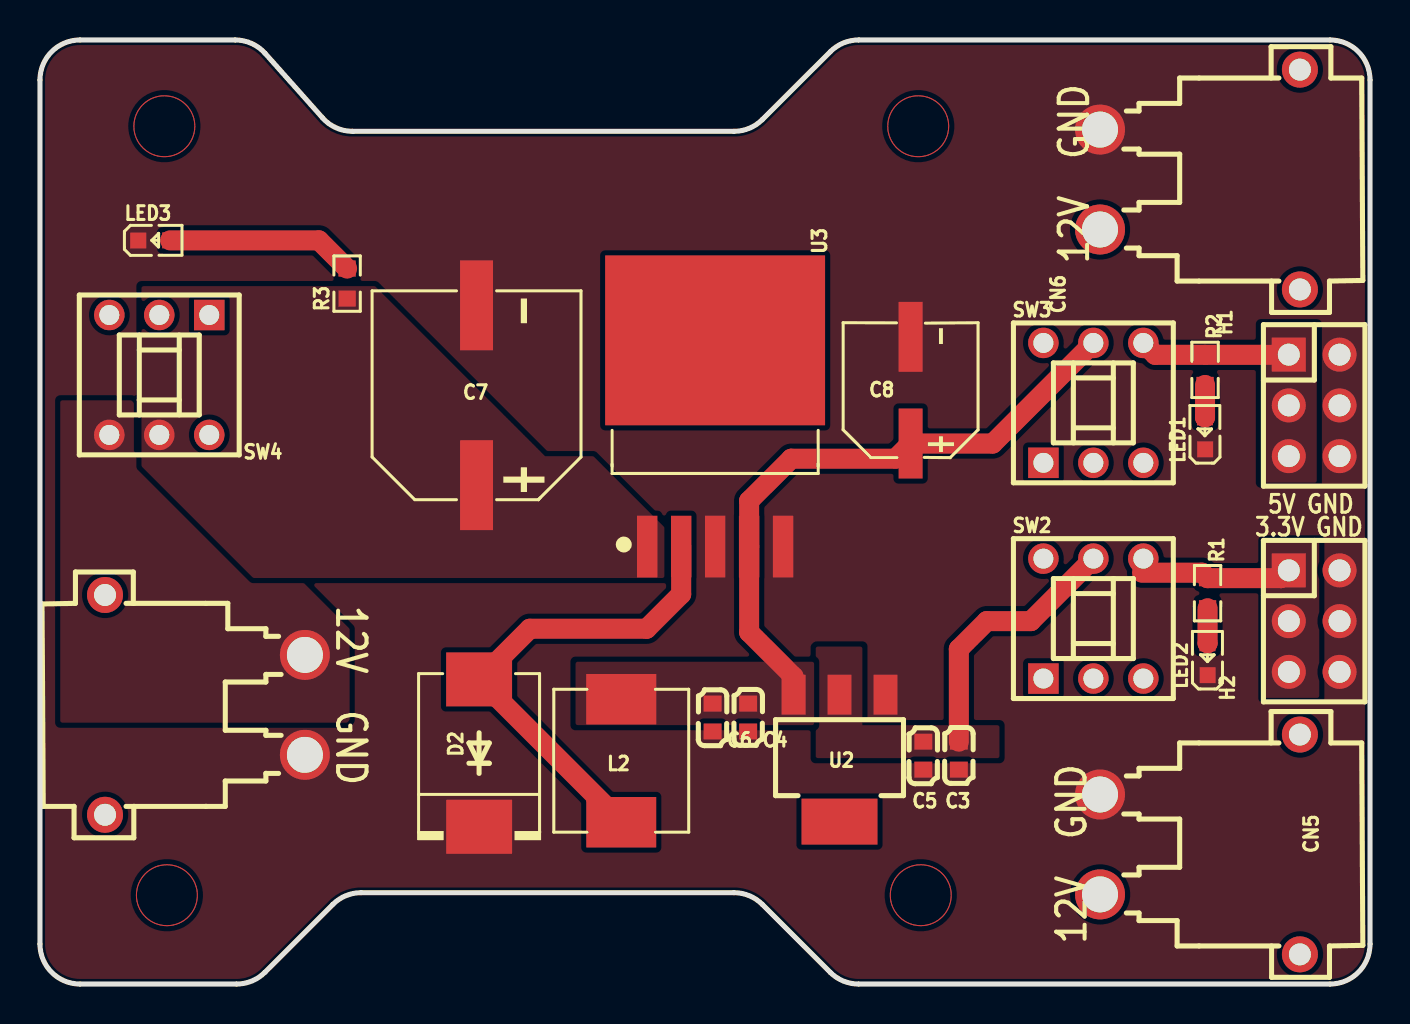
[diagram p3: board, top side]
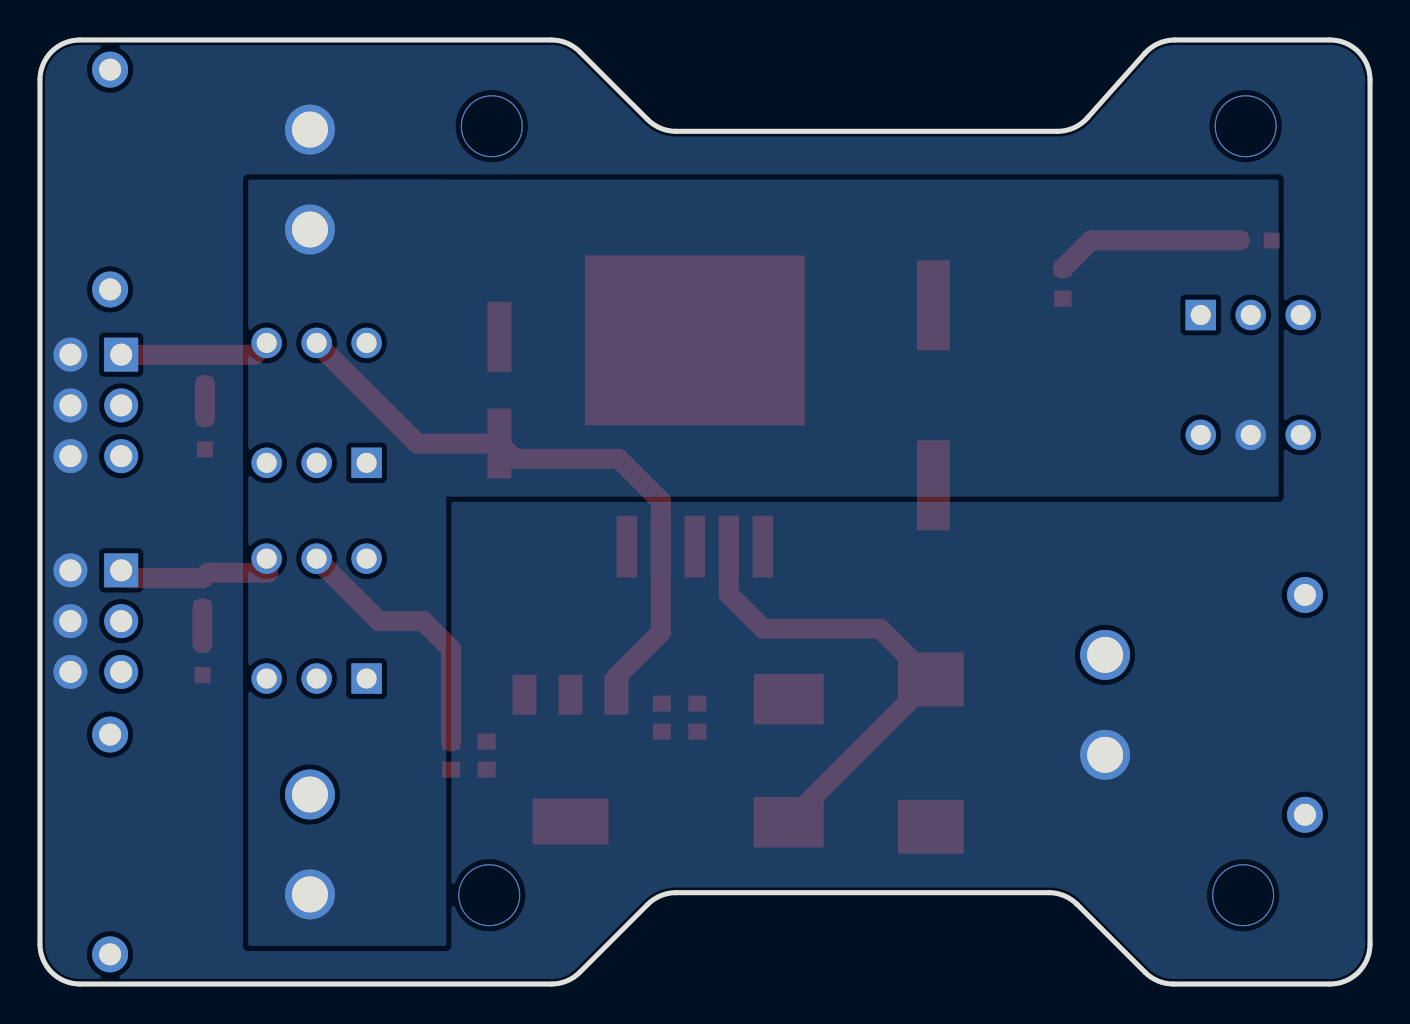
[diagram p4: board, bottom side, seen from below]

Outline 66.55 x 47.24 mm; copper layers: Top Layer, Bottom Layer. Coordinates in mm from the lower left corner of the outline.
Outline path: 0,45.24 0,2 arc(0.59,0.59) 2,0 9.84,0 arc(10.61,0.15) 11.25,0.59 14.65,3.99 arc(15.3,4.42) 16.07,4.57 34.73,4.57 arc(35.49,4.42) 36.14,3.99 39.54,0.59 arc(40.19,0.15) 40.95,0 64.55,0 arc(65.96,0.59) 66.55,2 66.55,45.24 arc(65.96,46.66) 64.55,47.24 40.96,47.24 arc(40.19,47.09) 39.55,46.66 36.14,43.26 arc(35.49,42.82) 34.73,42.67 15.63,42.67 arc(14.82,42.85) 14.14,43.34 11.26,46.57 arc(10.59,47.07) 9.77,47.24 2,47.24 arc(0.59,46.66) 0,45.24
Stack: Top Layer 0.035mm / Dielectric1 1.51mm FR4 er 4.5 / Bottom Layer 0.035mm

## Design rules (mm)
template: 用户自定义配置
spacing safeClearance (default): track to track 0.152, other pairs 0.152 to 0.3
track width trackWidth (default): min 0.127, default 0.254, max 2.54
differential pair differentialPair (default): width min 0.127, default 0.254, max 2.54; gap min 0.152, default 0.152
via viaSize (default): diameter min 0.5, default 0.61, max 10; hole min 0.3, default 0.305, max 5.999

## Placement (name value [footprint] x y rotation side)
C3  10uF  [C0603]  45.97 11.43 270 top
C4  10uF  [C0603]  35.43 13.34 270 top
C5  100nF  [C0603]  44.2 11.43 90 top
C6  100nF  [C0603]  33.65 13.34 90 top
C7  680uF  [CAP-SMD_BD10.0-L10.3-W10.3-LS10.9-FD]  21.84 29.46 90 top
C8  220uF  [CAP-SMD_BD6.3-L6.6-W6.6-LS7.8-FD]  43.56 29.72 90 top
CN4  XT30PW-M30.G.Y  [CONN-TH_XT30PW-M]  8.25 13.97 270 top
CN5  XT30PW-M30.G.Y  [CONN-TH_XT30PW-M]  58.04 6.99 90 top
CN6  XT30PW-M30.G.Y  [CONN-TH_XT30PW-M]  58.04 40.26 90 top
D2  SS34  [SMC_L6.9-W5.9-LS7.9-RD]  21.97 11.56 90 top
H1  PZ254V-12-6P  [HDR-TH_6P-P2.54-V-M-R2-C3-S2.54]  63.75 28.96 270 top
H2  PZ254V-12-6P  [HDR-TH_6P-P2.54-V-M-R2-C3-S2.54]  63.75 18.16 270 top
L2  33uH  [IND-SMD_L7.0-W6.6_FXL0650]  29.08 11.18 90 top
LED1  NCD0603  [LED0603-RD_RED]  58.29 27.56 90 top
LED2  NCD0603  [LED0603-RD_RED]  58.42 16.26 90 top
LED3  NCD0603  [LED0603-RD_RED]  5.71 37.21 0 top
R1  400Ω  [R0603]  58.42 19.56 270 top
R2  400Ω  [R0603]  58.29 30.73 270 top
R3  800Ω  [R0603]  15.37 35.05 90 top
SW2  XKB8080-Z  [SW-TH_6P-L8.0-W8.0-P2.50]  52.7 18.29 0 top
SW3  XKB8080-Z  [SW-TH_6P-L8.0-W8.0-P2.50]  52.7 29.08 0 top
SW4  XKB8080-Z  [SW-TH_6P-L8.0-W8.0-P2.50]  5.97 30.48 180 top
U2  AMS1117-3.3_C498117  [PG-SOT223-4_L6.5-W3.5-P2.30-LS7.0-BR]  40 11.3 90 top
U3  LM2596S-5.0(UMW)  [TO-263-5_L10.2-W8.9-P1.70-BR]  33.78 27.05 270 top

## Footprints (pads in the part's own frame, mm; a bottom-side part is the same pattern mirrored in y, then rotated)
C0603
  rect 0.8x0.9 smd: 1(-0.7,0) 2(0.7,0)
CAP-SMD_BD6.3-L6.6-W6.6-LS7.8-FD
  rect 3.5x1.2 smd: 1(-2.67,0) 2(2.67,0)
CAP-SMD_BD10.0-L10.3-W10.3-LS10.9-FD
  rect 4.5x1.65 smd: 1(-4.5,0) 2(4.5,0)
CONN-TH_XT30PW-M
  round 2.5 hole 1.8: 1(-2.5,5) 2(2.5,5)
  round 1.8 hole 1.1: 3(5.5,-5) 4(-5.5,-5)
HDR-TH_6P-P2.54-V-M-R2-C3-S2.54
  rect 1.7x1.7 hole 1.1: 1(-2.54,-1.27)
  round 1.7 hole 1.1: 2(-2.54,1.27) 3(0,-1.27) 4(0,1.27) 5(2.54,-1.27) 6(2.54,1.27)
IND-SMD_L7.0-W6.6_FXL0650
  rect 2.524x3.5 smd: 1(3.078,0) 2(-3.078,0)
LED0603-RD_RED
  rect 0.8x0.8 smd: 1(-0.799,-0.004) 2(0.799,0.004)
PG-SOT223-4_L6.5-W3.5-P2.30-LS7.0-BR
  rect 2x1.2 smd: 1(3.175,-2.3) 2(3.175,0) 3(3.175,2.3)
  rect 2.3x3.8 smd: 4(-3.175,0)
R0603
  rect 0.806x0.864 smd: 1(-0.753,0) 2(0.753,0)
SMC_L6.9-W5.9-LS7.9-RD
  rect 2.7x3.3 smd: 1(-3.687,0) 2(3.687,0)
SW-TH_6P-L8.0-W8.0-P2.50
  rect 1.524x1.524 hole 1: 1(-2.5,-3)
  round 1.524 hole 1: 2(0,-3) 3(2.5,-3) 4(-2.5,3) 5(0,3) 6(2.5,3)
TO-263-5_L10.2-W8.9-P1.70-BR
  rect 3.083x1.02 smd: 1(5.16,-3.4) 2(5.16,-1.7) 3(5.16,0) 4(5.16,1.7) 5(5.16,3.4)
  rect 8.5x11 smd: 6(-5.16,0)

## Nets
3.3V: C3.1 C5.2 SW2.5 U2.2
5V: C4.1 C6.2 C8.1 L2.1 SW3.5 U2.3 U3.4
12V: C7.1 CN5.1 CN6.1 R3.1 SW4.5 U3.1
GND: C3.2 C4.2 C5.1 C6.1 C7.2 C8.2 CN4.2 CN5.2 CN6.2 D2.1 H1.2 H1.4 H1.6 H2.2 H2.4 H2.6 LED1.1 LED2.1 LED3.1 U2.1 U3.3 U3.5
VCC: CN4.1 SW4.6
$1N1457: D2.2 L2.2 U3.2
$1N2113: H1.1 H1.3 H1.5 R2.1 SW3.6
$1N2166: H2.1 H2.3 H2.5 R1.1 SW2.6
$1N4140: LED1.2 R2.2
$1N4171: LED2.2 R1.2
$1N4370: LED3.2 R3.2

Pads without a net: CN4 3 4; CN5 3 4; CN6 3 4; SW2 1 2 3 4; SW3 1 2 3 4; SW4 1 2 3 4; U2 4; U3 6

## Via types
v1: diameter 3.1, hole 3, Top Layer to Bottom Layer, 4 vias

## Routing (per net, layer and track width the routed paths; a pad name or vN(x,y) marks a point on that pad's centre or on a via; arc(x,y) is an arc through that point)
3.3V: length 13.2
  Top Layer w1: SW2.5 49.58,18.16 47.37,18.16 45.97,16.76 C3.1
5V: length 31.1
  Top Layer w1: U2.3 37.7,15.38 35.48,17.6 U3.4 35.48,24.18 37.59,26.29 42.8,26.29 C8.1 47.67,27.05 SW3.5
(no net):
  vias: v1(6.22,42.93) v1(6.35,4.45) v1(43.94,42.93) v1(44.07,4.45)
$1N1457: length 24.4
  Top Layer w1: U3.2 32.08,19.51 30.35,17.78 24.51,17.78 D2.2 29.08,8.13 L2.2
$1N2113: length 7.5
  Top Layer w1: H1.1 62.48,31.49 R2.1 55.8,31.49 SW3.6
$1N2166: length 7.6
  Top Layer w1: 55.14,20.59 58.15,20.59 R1.1 62.09,20.31 H2.1
$1N4140: length 1.6
  Top Layer w1: LED1.2 58.29,28.36 R2.2
$1N4171: length 1.8
  Top Layer w1: LED2.2 58.42,17.06 R1.2
$1N4370: length 9.4
  Top Layer w1: R3.2 13.96,37.21 LED3.2

## Copper pours and planes (outline as drawn; the poured copper is in the pictures)
3.3V on Top Layer: 38.86,16.89 41.15,16.89 41.15,12.95 48.01,12.95 48.01,11.3 38.81,11.3 38.81,16.84
5V on Top Layer: 26.8,16.13 38.73,16.13 38.73,12.95 26.8,12.95
12V on Top Layer: 5.08,34.93 16.76,34.93 25.27,26.42 27.69,26.42 31.24,22.86 31.24,20.32 10.67,20.32 5.08,25.91
12V on Bottom Layer: 4.57,40.26 51.56,40.26 51.56,24.38 4.57,24.38
12V on Bottom Layer: 46.22,40.26 56.13,40.26 56.13,1.91 46.22,1.91
GND on Top Layer: -2.41,48.13 68.96,48.13 68.96,-1.14 -2.41,-1.14
GND on Bottom Layer: -2.29,49.02 72.64,49.02 72.64,-3.17 -2.29,-3.17
VCC on Top Layer: 1.02,29.21 1.02,13.08 15.37,13.08 15.49,13.21 15.49,17.78 13.01,20.26 9.78,21.97 7.4,23.97 4.7,26.67 4.7,29.08 4.57,29.21
$1N2113 on Top Layer: 61.09,33.02 63.88,33.02 63.88,25.09 61.09,25.09
$1N2166 on Top Layer: 61.21,22.2 64.01,22.2 64.01,14.32 61.21,14.32

## Text on the board
Top Silkscreen Layer: 3.3V GND | 5V GND | 12V  GND

# Board PCB_12V转5v验证电路 copy_1
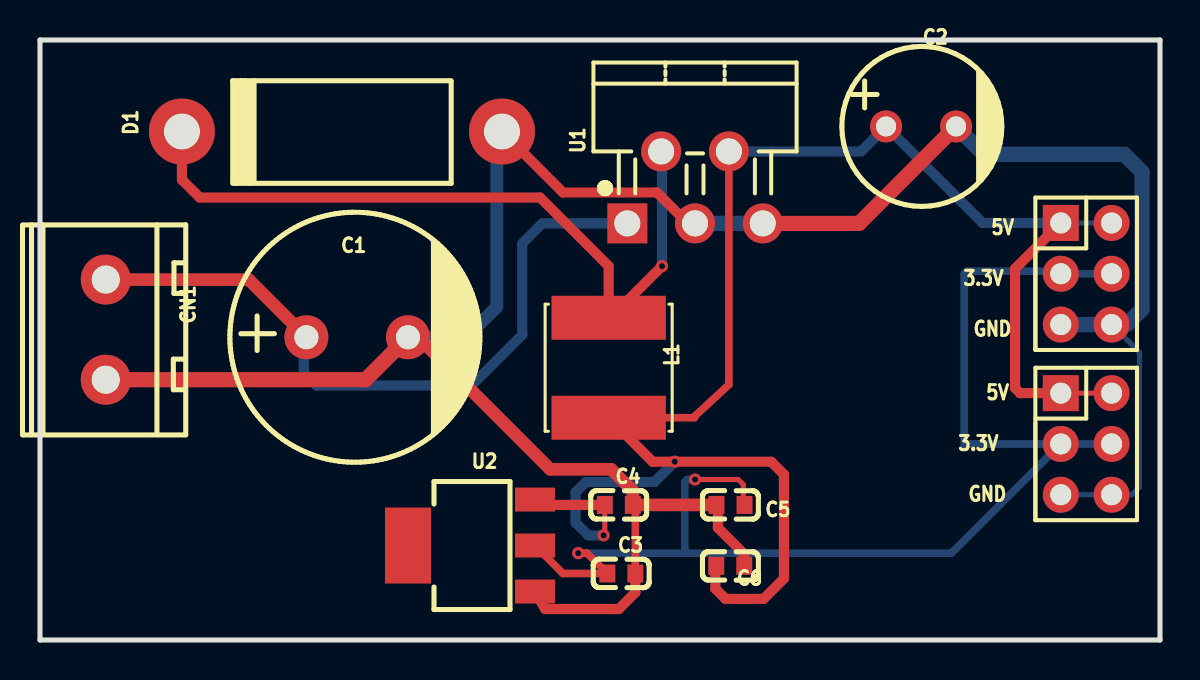
[diagram p5: board, top side]
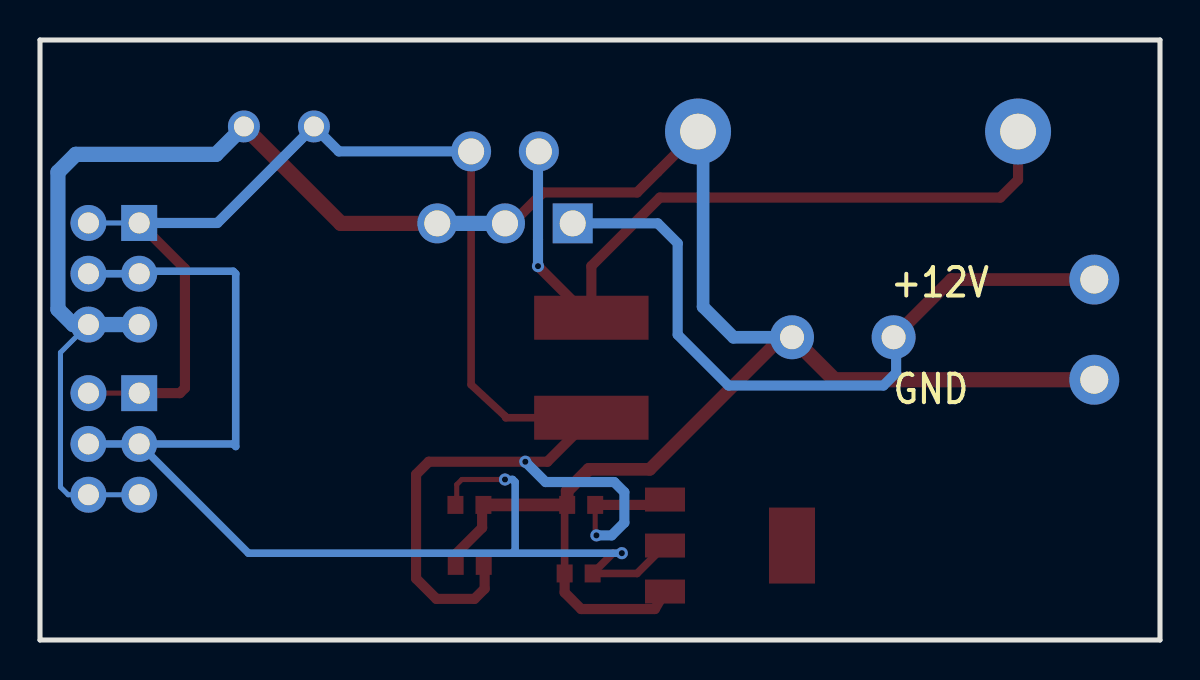
[diagram p6: board, bottom side, seen from below]

Outline 56 x 30 mm; copper layers: Top Layer, Bottom Layer. Coordinates in mm from the lower left corner of the outline.
Outline path: 0,30 56,30 56,0 0,0 0,30

## Placement (name value [footprint] x y rotation side)
C1  680uF  [CAP-TH_BD12.5-P5.00-D1.2-FD]  15.86 15.14 0 top
C2  220uF  [CAP-TH_BD8.0-P3.50-D1.0-FD]  44.05 25.68 0 top
C3  10uF  [C0603]  29.07 3.33 0 top
C4  10uF  [C0603]  28.94 6.75 0 top
C5  100nF  [C0603]  34.53 6.75 0 top
C6  100nF  [C0603]  34.51 3.71 180 top
CN1  WJ127-5.0-2P_C187897  [CONN-TH_2P-P5.00_WJ127-5.0-2P]  3.29 15.52 270 top
D1  1N5824  [IN5824]  15.1 25.42 90 top
J1  Header-Male-2.54_2x3  [HDR-TH_6P-P2.54-V-R2-C3-S2.54]  52.31 9.8 270 top
J2  Header-Male-2.54_2x3  [HDR-TH_6P-P2.54-V-R2-C3-S2.54]  52.31 18.31 270 top
L1  33uH  [IND-SMD_L6.0-W6.0]  28.43 13.61 270 top
U1  LM2596T-5.0/NOPB  [TO-220-5_L10.5-W15.5-P1.70-TL]  32.75 22.63 90 top
U2  AMS1117-3.3_C498117  [PG-SOT223-4_L6.5-W3.5-P2.30-LS7.0-BR]  21.57 4.72 0 top

## Footprints (pads in the part's own frame, mm; a bottom-side part is the same pattern mirrored in y, then rotated)
C0603
  rect 0.8x0.9 smd: 1(-0.7,0) 2(0.7,0)
CAP-TH_BD8.0-P3.50-D1.0-FD
  round 1.6 hole 1: 1(-1.75,0) 2(1.75,0)
CAP-TH_BD12.5-P5.00-D1.2-FD
  round 2.2 hole 1.2: 1(-2.54,0) 2(2.54,0)
CONN-TH_2P-P5.00_WJ127-5.0-2P
  round 2.5 hole 1.4: 1(-2.505,0) 2(2.505,0)
HDR-TH_6P-P2.54-V-R2-C3-S2.54
  rect 1.8x1.8 hole 1.05: 1(-2.54,-1.27)
  round 1.8 hole 1.05: 2(-2.54,1.27) 3(0,-1.27) 4(0,1.27) 5(2.54,-1.27) 6(2.54,1.27)
IN5824
  round 3.302 hole 1.778x1.783: 1(0,-8.001) 2(0,8.001)
IND-SMD_L6.0-W6.0
  rect 2.2x5.72 smd: 1(-2.5,0) 2(2.5,0)
PG-SOT223-4_L6.5-W3.5-P2.30-LS7.0-BR
  rect 2x1.2 smd: 1(3.175,-2.3) 2(3.175,0) 3(3.175,2.3)
  rect 2.3x3.8 smd: 4(-3.175,0)
TO-220-5_L10.5-W15.5-P1.70-TL
  rect 2x2 hole 1.3: 1(-1.8,3.386)
  round 2 hole 1.3: 2(1.8,1.694) 3(-1.8,0) 4(1.8,-1.694) 5(-1.8,-3.386)

## Nets
As in the schematic.

Pads without a net: U2 4

## Via types
v1: diameter 0.61, hole 0.305, Top Layer to Bottom Layer, 5 vias

## Routing (per net, layer and track width the routed paths; a pad name or vN(x,y) marks a point on that pad's centre or on a via; arc(x,y) is an arc through that point)
3.3V: length 63.7
  Top Layer w0.254: C5.2 35.16,6.82 35.16,7.77 34.91,8.03 v1(32.75,8.03)
  Top Layer w0.381: v1(26.91,4.34) 27.35,4.34 C3.1 26.15,3.33 U2.2
  Bottom Layer w0.381: J1.3 46.34,9.8 46.21,9.68 46.21,18.31 46.34,18.44 50.91,18.44 J2.3 J2.4 ; J1.3 45.58,4.34 v1(26.91,4.34) ; J1.3 J1.4 ; 32.39,4.34 32.24,4.48 32.24,7.9 32.37,8.03 v1(32.75,8.03)
5V: length 88.4
  Top Layer w0.254: v1(28.18,5.23) 28.24,5.29 C4.1 ; J1.1 J1.2
  Top Layer w0.381: L1.2 32.71,11.11 32.75,11.2 34.44,12.77 U1.4
  Top Layer w0.508: 33.81,3.71 33.77,3.66 33.77,2.56 34.28,2.06 36.18,2.06 37.2,3.07 37.2,8.28 36.56,8.91 v1(31.74,8.91) 30.63,8.91 L1.2 ; C4.1 25.02,6.75 U2.3 ; J2.1 48.75,18.57 48.75,12.6 49.01,12.34 J1.1
  Bottom Layer w0.254: J2.1 J2.2
  Bottom Layer w0.508: U1.4 41.06,24.43 C2.1 47.13,20.85 J2.1 ; v1(31.74,8.91) 30.72,7.9 27.29,7.9 26.78,7.39 26.78,5.87 27.42,5.23 v1(28.18,5.23)
12V: length 35.5
  Top Layer w0.635: C1.1 10.43,18.02 CN1.1
  Bottom Layer w0.508: 29.37,20.83 25.11,20.83 24.12,19.84 24.12,15.26 21.57,12.72 13.83,12.72 13.19,13.36 13.19,15.01 C1.1
GND: length 124.1
  Top Layer w0.381: C3.2 29.77,6.63 C4.2
  Top Layer w0.508: C6.1 35.21,4.29 33.89,5.61 33.89,6.69 C5.1 ; U2.1 25.26,1.55 28.94,1.55 29.77,2.38 C3.2 ; D1.1 26.15,22.38 30.85,22.38 32.39,20.83 32.75,20.83
  Top Layer w0.635: C1.2 18.91,15.14 25.51,8.53 28.56,8.53 29.64,7.45 29.64,6.75 ; C5.1 C4.2
  Top Layer w0.762: C1.2 16.28,13.01 CN1.2 ; C2.2 40.96,20.83 U1.5
  Bottom Layer w0.254: 51.04,7.26 54.59,7.26 54.98,7.64 54.98,14.38 J2.6
  Bottom Layer w0.635: D1.1 22.84,25.17 22.84,16.66 21.32,15.14 C1.2
  Bottom Layer w0.762: J2.5 J2.6 54.34,15.77 55.1,16.53 55.1,23.39 54.21,24.28 47.2,24.28 C2.2 ; U1.3 U1.5
U1_2: length 37.6
  Top Layer w0.508: v1(31.1,18.69) 28.52,16.11 L1.1 28.43,18.69 25,22.12 7.99,22.12 7.1,23.01 7.1,25.42
  Bottom Layer w0.508: v1(31.1,18.69) 31.1,24.39 31.06,24.43

## Text on the board
Bottom Silkscreen Layer: GND | +12V
Top Silkscreen Layer: 3.3V | GND | 5V

# Board PCB_12V转5v验证电路 copy_2
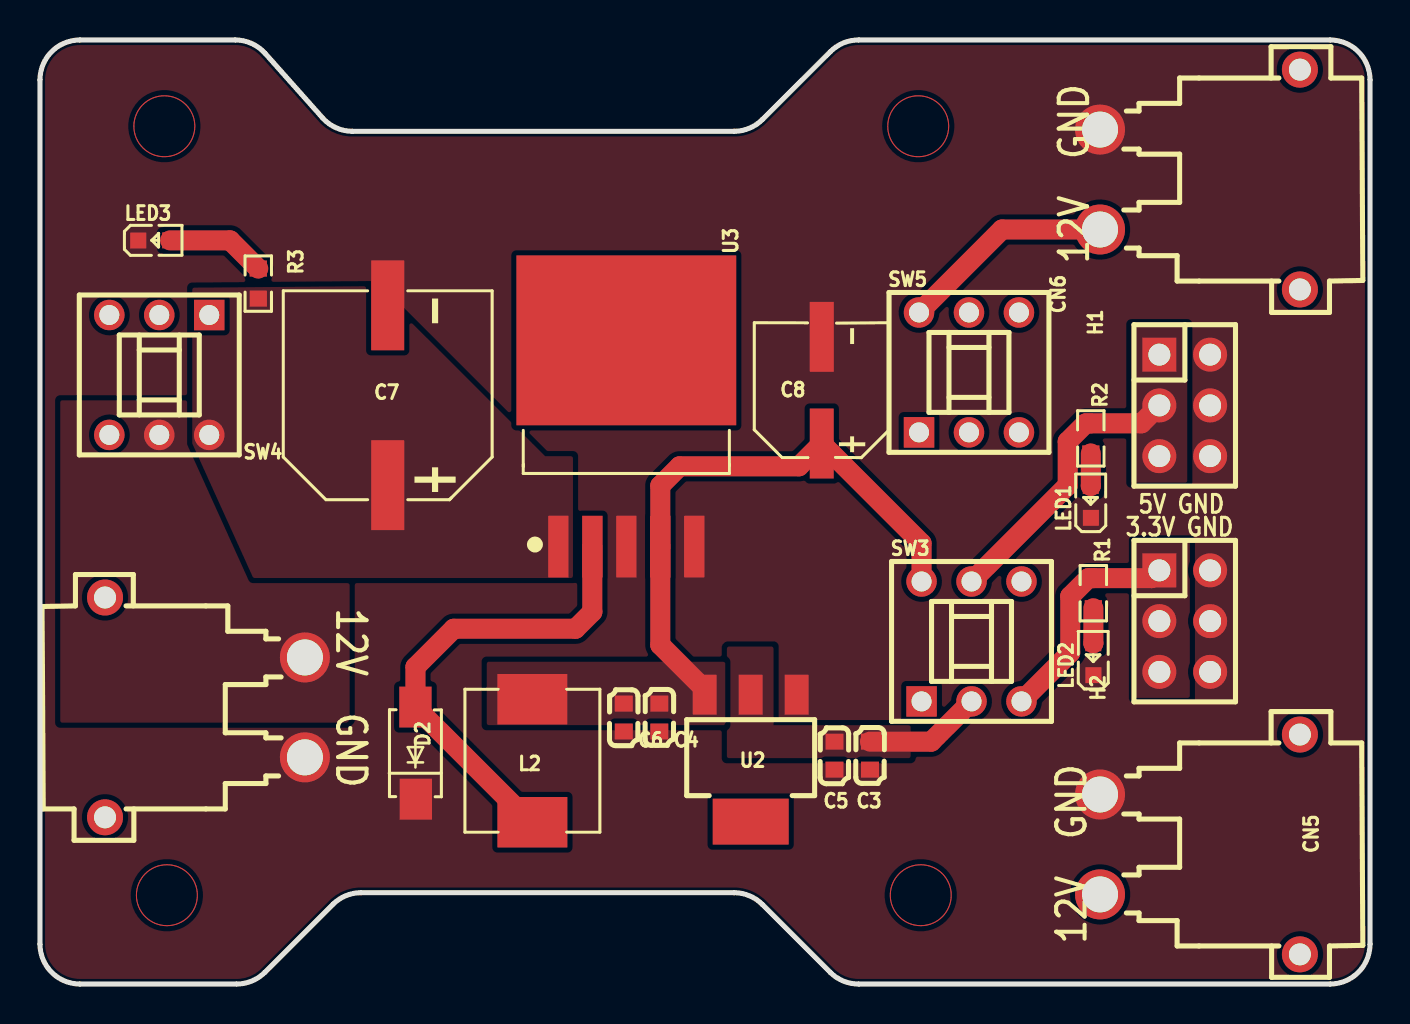
[diagram p7: board, top side]
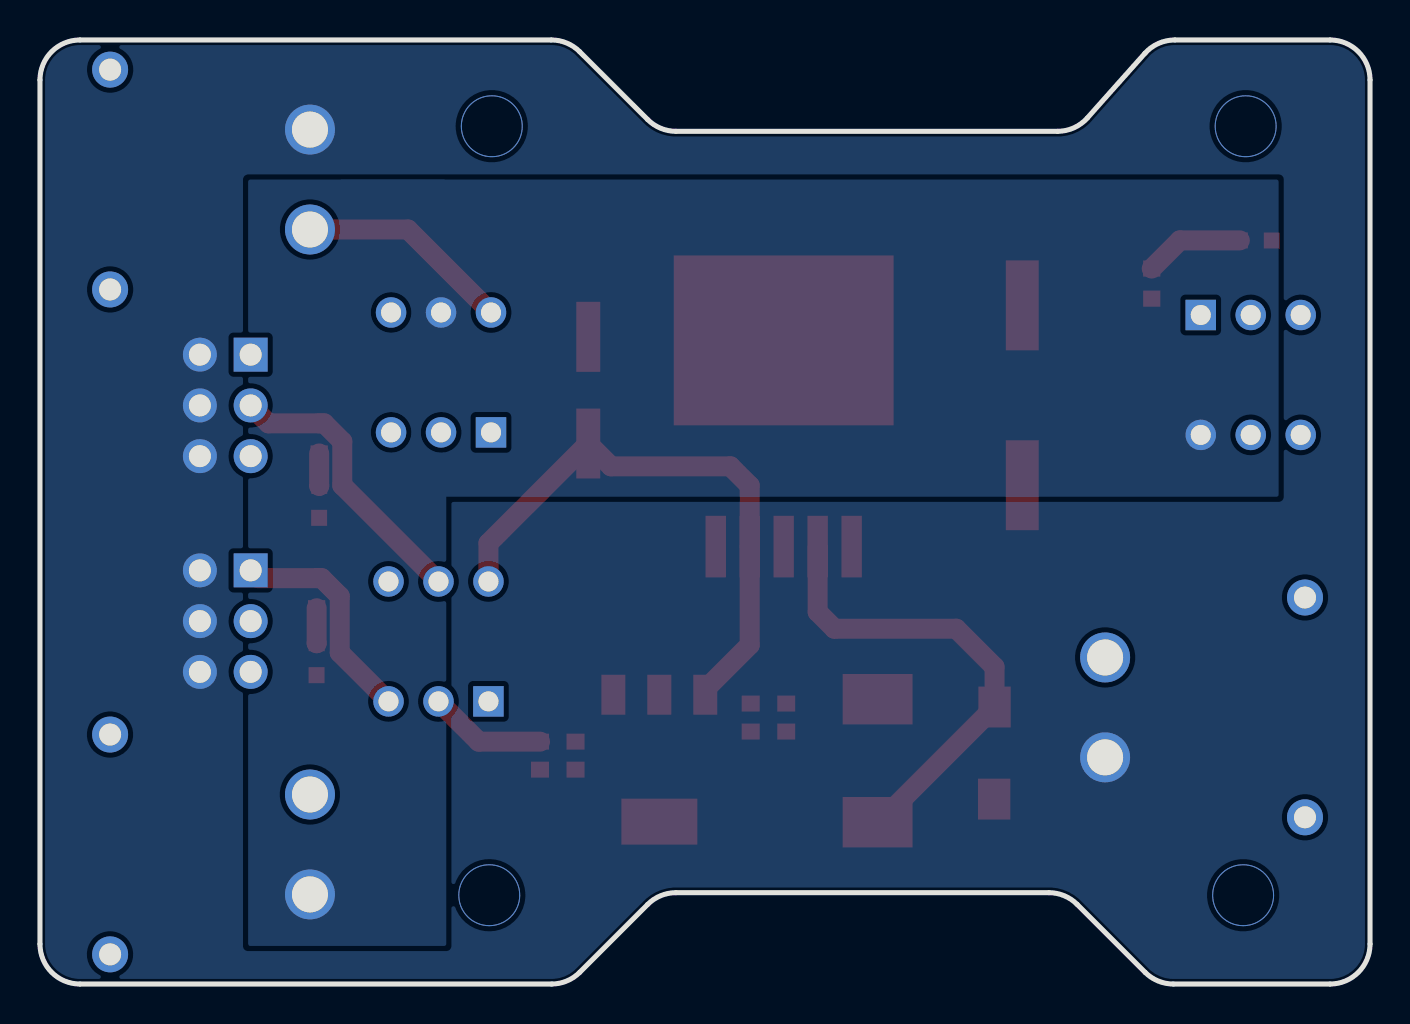
[diagram p8: board, bottom side, seen from below]

Outline 66.55 x 47.24 mm; copper layers: Top Layer, Bottom Layer. Coordinates in mm from the lower left corner of the outline.
Outline path: 0,45.24 0,2 arc(0.59,0.59) 2,0 9.84,0 arc(10.61,0.15) 11.25,0.59 14.65,3.99 arc(15.3,4.42) 16.07,4.57 34.73,4.57 arc(35.49,4.42) 36.14,3.99 39.54,0.59 arc(40.19,0.15) 40.95,0 64.55,0 arc(65.96,0.59) 66.55,2 66.55,45.24 arc(65.96,46.66) 64.55,47.24 40.96,47.24 arc(40.19,47.09) 39.55,46.66 36.14,43.26 arc(35.49,42.82) 34.73,42.67 15.63,42.67 arc(14.82,42.85) 14.14,43.34 11.26,46.57 arc(10.59,47.07) 9.77,47.24 2,47.24 arc(0.59,46.66) 0,45.24
Stack: Top Layer 0.035mm / Dielectric1 1.51mm FR4 er 4.5 / Bottom Layer 0.035mm

## Design rules (mm)
template: 用户自定义配置
spacing safeClearance (default): track to track 0.152, other pairs 0.152 to 0.3
track width trackWidth (default): min 0.127, default 0.254, max 2.54
differential pair differentialPair (default): width min 0.127, default 0.254, max 2.54; gap min 0.152, default 0.152
via viaSize (default): diameter min 0.5, default 0.61, max 10; hole min 0.3, default 0.305, max 5.999

## Placement (name value [footprint] x y rotation side)
C3  10uF  [C0603]  41.53 11.43 270 top
C4  10uF  [C0603]  30.99 13.34 270 top
C5  100nF  [C0603]  39.75 11.43 90 top
C6  100nF  [C0603]  29.21 13.34 90 top
C7  680uF  [CAP-SMD_BD10.0-L10.3-W10.3-LS10.9-FD]  17.4 29.46 90 top
C8  220uF  [CAP-SMD_BD6.3-L6.6-W6.6-LS7.8-FD]  39.12 29.72 90 top
CN4  XT30PW-M30.G.Y  [CONN-TH_XT30PW-M]  8.25 13.84 270 top
CN5  XT30PW-M30.G.Y  [CONN-TH_XT30PW-M]  58.04 6.99 90 top
CN6  XT30PW-M30.G.Y  [CONN-TH_XT30PW-M]  58.04 40.26 90 top
D2  SS34  [SMA_L4.3-W2.6-LS5.0-FD]  18.8 11.56 270 top
H1  PZ254V-12-6P  [HDR-TH_6P-P2.54-V-M-R2-C3-S2.54]  57.28 28.96 270 top
H2  PZ254V-12-6P  [HDR-TH_6P-P2.54-V-M-R2-C3-S2.54]  57.28 18.16 270 top
L2  33uH  [IND-SMD_L7.0-W6.6_FXL0650]  24.64 11.18 90 top
LED1  NCD0603  [LED0603-RD_RED]  52.58 24.13 90 top
LED2  NCD0603  [LED0603-RD_RED]  52.7 16.26 90 top
LED3  NCD0603  [LED0603-RD_RED]  5.71 37.21 0 top
R1  400Ω  [R0603]  52.7 19.56 270 top
R2  400Ω  [R0603]  52.58 27.31 270 top
R3  800Ω  [R0603]  10.92 35.05 90 top
SW3  XKB8080-Z  [SW-TH_6P-L8.0-W8.0-P2.50]  46.61 17.15 0 top
SW4  XKB8080-Z  [SW-TH_6P-L8.0-W8.0-P2.50]  5.97 30.48 180 top
SW5  XKB8080-Z  [SW-TH_6P-L8.0-W8.0-P2.50]  46.48 30.61 0 top
U2  AMS1117-3.3_C498117  [PG-SOT223-4_L6.5-W3.5-P2.30-LS7.0-BR]  35.56 11.3 90 top
U3  LM2596S-5.0(UMW)  [TO-263-5_L10.2-W8.9-P1.70-BR]  29.34 27.05 270 top

## Footprints (pads in the part's own frame, mm; a bottom-side part is the same pattern mirrored in y, then rotated)
C0603
  rect 0.8x0.9 smd: 1(-0.7,0) 2(0.7,0)
CAP-SMD_BD6.3-L6.6-W6.6-LS7.8-FD
  rect 3.5x1.2 smd: 1(-2.67,0) 2(2.67,0)
CAP-SMD_BD10.0-L10.3-W10.3-LS10.9-FD
  rect 4.5x1.65 smd: 1(-4.5,0) 2(4.5,0)
CONN-TH_XT30PW-M
  round 2.5 hole 1.8: 1(-2.5,5) 2(2.5,5)
  round 1.8 hole 1.1: 3(5.5,-5) 4(-5.5,-5)
HDR-TH_6P-P2.54-V-M-R2-C3-S2.54
  rect 1.7x1.7 hole 1.1: 1(-2.54,-1.27)
  round 1.7 hole 1.1: 2(-2.54,1.27) 3(0,-1.27) 4(0,1.27) 5(2.54,-1.27) 6(2.54,1.27)
IND-SMD_L7.0-W6.6_FXL0650
  rect 2.524x3.5 smd: 1(3.078,0) 2(-3.078,0)
LED0603-RD_RED
  rect 0.8x0.8 smd: 1(-0.799,-0.004) 2(0.799,0.004)
PG-SOT223-4_L6.5-W3.5-P2.30-LS7.0-BR
  rect 2x1.2 smd: 1(3.175,-2.3) 2(3.175,0) 3(3.175,2.3)
  rect 2.3x3.8 smd: 4(-3.175,0)
R0603
  rect 0.806x0.864 smd: 1(-0.753,0) 2(0.753,0)
SMA_L4.3-W2.6-LS5.0-FD
  rect 2.046x1.62 smd: 1(-2.304,-0.009) 2(2.304,0.009)
SW-TH_6P-L8.0-W8.0-P2.50
  rect 1.524x1.524 hole 1: 1(-2.5,-3)
  round 1.524 hole 1: 2(0,-3) 3(2.5,-3) 4(-2.5,3) 5(0,3) 6(2.5,3)
TO-263-5_L10.2-W8.9-P1.70-BR
  rect 3.083x1.02 smd: 1(5.16,-3.4) 2(5.16,-1.7) 3(5.16,0) 4(5.16,1.7) 5(5.16,3.4)
  rect 8.5x11 smd: 6(-5.16,0)

## Nets
As in the schematic.

Pads without a net: CN4 3 4; CN5 3 4; CN6 3 4; SW3 1 6; SW4 1 2 3 6; SW5 1 2 3 6; U2 4; U3 6

## Via types
v1: diameter 3.1, hole 3, Top Layer to Bottom Layer, 4 vias

## Routing (per net, layer and track width the routed paths; a pad name or vN(x,y) marks a point on that pad's centre or on a via; arc(x,y) is an arc through that point)
3.3V: length 5.9
  Top Layer w1: SW3.2 44.59,12.13 C3.1
5V: length 29.3
  Top Layer w1: SW3.4 44.11,22.06 C8.1 37.98,25.91 32,25.91 31.04,24.94 U3.4 31.04,16.97 33.26,14.75 33.26,14.48
(no net):
  vias: v1(6.22,42.93) v1(6.35,4.45) v1(43.94,42.93) v1(44.07,4.45)
$1N1457: length 23.5
  Top Layer w1: L2.2 24.55,8.1 D2.1 18.79,15.87 20.7,17.78 26.8,17.78 27.64,18.62 U3.2
$1N2113: length 14.3
  Top Layer w1: H1.3 55.11,28.06 R2.1 52.33,28.06 51.42,27.15 51.42,24.96 SW3.5
$1N2166: length 11.3
  Top Layer w1: SW3.3 51.55,16.59 51.55,19.41 52.45,20.31 R1.1 55.62,20.31 H2.1
$1N4140: length 1.6
  Top Layer w1: LED1.2 52.58,24.93 R2.2
$1N4171: length 1.8
  Top Layer w1: R1.2 52.7,17.06 LED2.2
$1N4370: length 5
  Top Layer w1: R3.2 9.51,37.21 LED3.2
$1N6771: length 10.8
  Top Layer w1: CN6.1 48.13,37.76 SW5.4

## Copper pours and planes (outline as drawn; the poured copper is in the pictures)
3.3V on Top Layer: 34.42,16.89 36.7,16.89 36.7,12.95 43.56,12.95 43.56,11.3 34.37,11.3 34.37,16.84
5V on Top Layer: 22.35,16.13 34.29,16.13 34.29,12.95 22.35,12.95
12V on Top Layer: 7.62,34.85 16.76,34.93 25.27,26.42 26.67,26.42 26.67,20.32 10.67,20.32 7.62,27.05
12V on Bottom Layer: 46.22,40.26 56.13,40.26 56.13,1.91 46.22,1.91
12V on Bottom Layer: 4.57,40.26 51.56,40.26 51.56,24.38 4.57,24.38
GND on Top Layer: -2.41,48.13 68.96,48.13 68.96,-1.14 -2.41,-1.14
GND on Bottom Layer: -2.29,49.02 72.64,49.02 72.64,-3.17 -2.29,-3.17
VCC on Top Layer: 1.02,29.21 1.02,13.08 15.37,13.08 15.49,13.21 15.49,20.88 10.67,20.88 7.4,29.21
$1N2113 on Top Layer: 54.61,33.02 57.4,33.02 57.4,25.09 54.61,25.09
$1N2166 on Top Layer: 54.74,22.2 57.53,22.2 57.53,14.32 54.74,14.32

## Text on the board
Top Silkscreen Layer: 3.3V GND | 5V GND | 12V  GND
